# Altium project ie-track-kit-arduino-1.PrjPcb
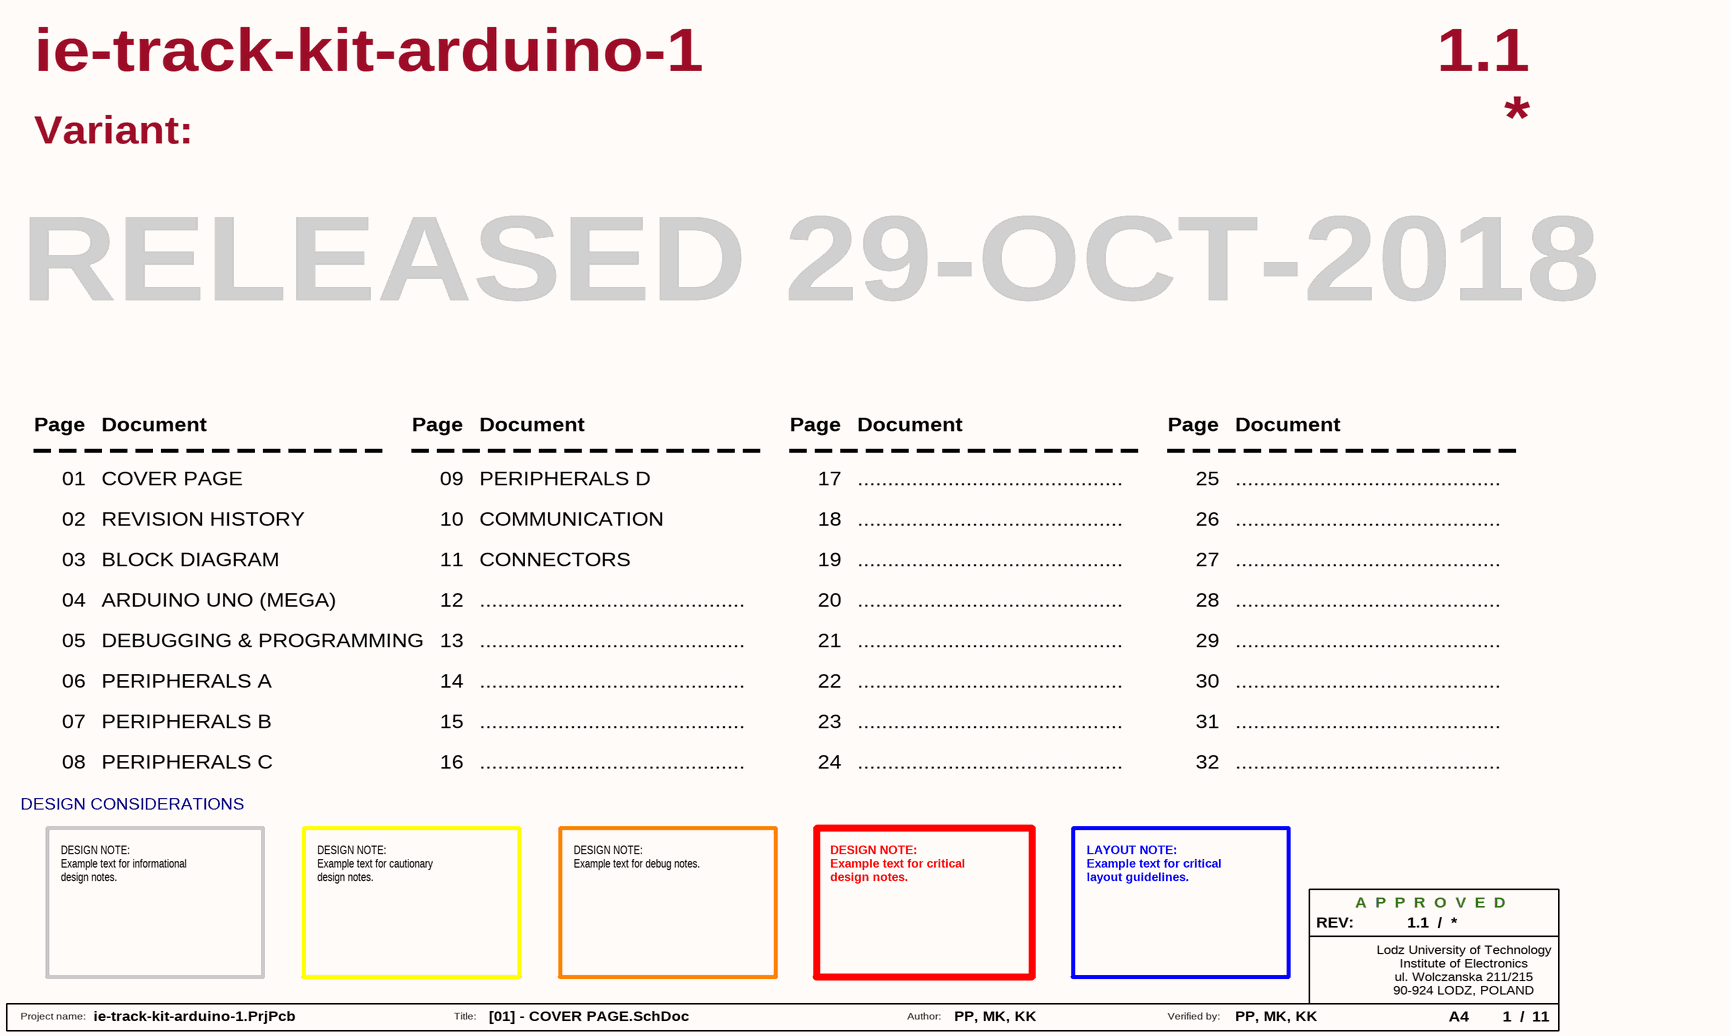
[diagram p0: [01] - COVER PAGE.SchDoc]
ProjectTitle: ie-track-kit-arduino-1; ProjectSheetTotal: 11; ProjectRevision: 1.1; ProjectDrawnBy: PP, MK, KK; ProjectCheckedBy: PP, MK, KK
11 sheets, 284 parts. Net scope: global (net labels, ports and power ports of the same name join across sheets).
Board file: ie-track-kit-arduino-1-V11.PcbDoc
Sheets:
  [01] - COVER PAGE.SchDoc
  [02] - REVISION HISTORY.SchDoc
  [03] - BLOCK DIAGRAM.SchDoc
    Voltage Conversion, Programming & Debug = [05] - DEBUGGING & PROGRAMMING.SchDoc
    Peripherals - A = [06] - PERIPHERALS A.SchDoc
    Bluetooth & 2,4GHz ISM = [10] - COMMUNICATION.SchDoc
    IE-TRACK-KIT-PWR Connector = [11] - CONNECTOR.SchDoc
    Arduino UNO/MEGA = [04] - ARDUINO UNO (MEGA).SchDoc
    Peripherals - B = [07] - PERIPHERALS B.SchDoc
    Peripherals - C = [08] - PERIPHERALS C.SchDoc
    Peripherals - D = [09] - PERIPHERALS D.SchDoc

## Sheet [01] - COVER PAGE.SchDoc: Test title
size A4; Projectnumber: OWN-000; Project name:: Test name; Date: YYYY-MM-DD; Engineer: X; SheetNumber: 1; Size: A4

### Notes on the sheet
- Variant:
- RELEASED 29-OCT-2018
- Page
- Document
- 01
- COVER PAGE
- 09
- PERIPHERALS D
- 17
- ............................................
- 25
- 02
- 03
- REVISION HISTORY
- BLOCK DIAGRAM
- 10
- 11
- COMMUNICATION
- CONNECTORS
- 18
- 19
- 26
- 27
- 04
- 05
- ARDUINO UNO (MEGA)
- DEBUGGING & PROGRAMMING
- 12
- 13
- 20
- 21
- 28
- 29
- 06
- PERIPHERALS A
- 14
- 22
- 30
- 07
- 08
- PERIPHERALS B
- PERIPHERALS C
- 15
- 16
- 23
- 24
- 31
- 32
- DESIGN CONSIDERATIONS
- DESIGN NOTE:
  Example text for informational
  design notes.
- DESIGN NOTE:
  Example text for cautionary
  design notes.
- DESIGN NOTE:
  Example text for debug notes.
- DESIGN NOTE:
  Example text for critical
  design notes.
- LAYOUT NOTE:
  Example text for critical
  layout guidelines.
- REV:
- A  P  P  R  O  V  E  D
- /
- Lodz University of Technology
- ul. Wolczanska 211/215
- 90-924 LODZ, POLAND
- Institute of Electronics
- Project name:
- Title:
- Author:
- Verified by:

## Sheet [02] - REVISION HISTORY.SchDoc: Test title
size A4; Project name:: Test name; Client: DSG; Date: YYYY-MM-DD; Engineer: X; SheetNumber: 2; Size: A4
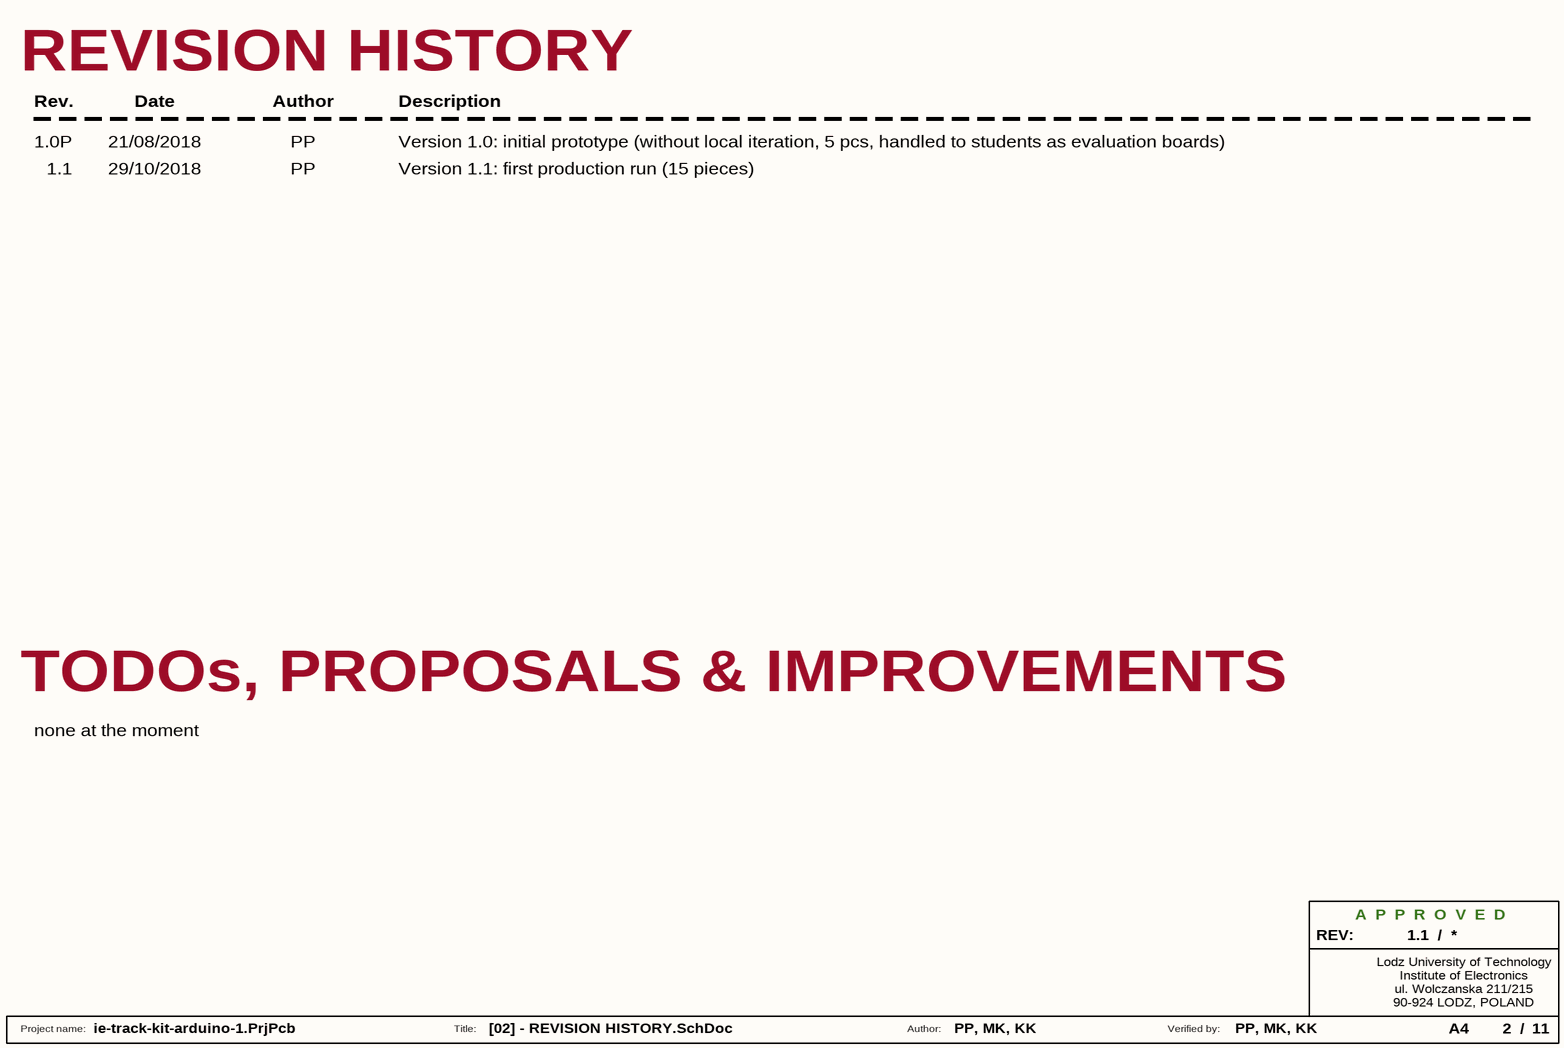
[diagram p1: [02] - REVISION HISTORY.SchDoc]

### Notes on the sheet
- REVISION HISTORY
- Rev.
- Date
- Author
- Description
- 1.0P
- 1.1
- 21/08/2018
- 29/10/2018
- PP
- Version 1.0: initial prototype (without local iteration, 5 pcs, handled to students as evaluation boards)
- Version 1.1: first production run (15 pieces)
- TODOs, PROPOSALS & IMPROVEMENTS
- none at the moment
- REV:
- A  P  P  R  O  V  E  D
- /
- Lodz University of Technology
- ul. Wolczanska 211/215
- 90-924 LODZ, POLAND
- Institute of Electronics
- Project name:
- Title:
- Author:
- Verified by:

## Sheet [03] - BLOCK DIAGRAM.SchDoc: Test title
size A4; PageSetup: Record=PageOptions|CenterHorizontal=True|CenterVertical=True|PrintScale=0.52|XCorrection=1.00|YCorrection=1.00|PrintKind=1|BorderSize=5000000|LeftOffset=0|BottomOffset=0|Orientation=2|PaperLength=1000|PaperWidth=1000|Scale=100|PaperSource=4|PrintQuality=600|MediaType=1|DitherType=10|PrintScaleMode=1|PaperKind=A4|PaperIndex=9; Projectnumber: OWN-000; Project name:: Test name; Client: DSG; Date: YYYY-MM-DD; Engineer: X; SheetNumber: 3; Size: A4
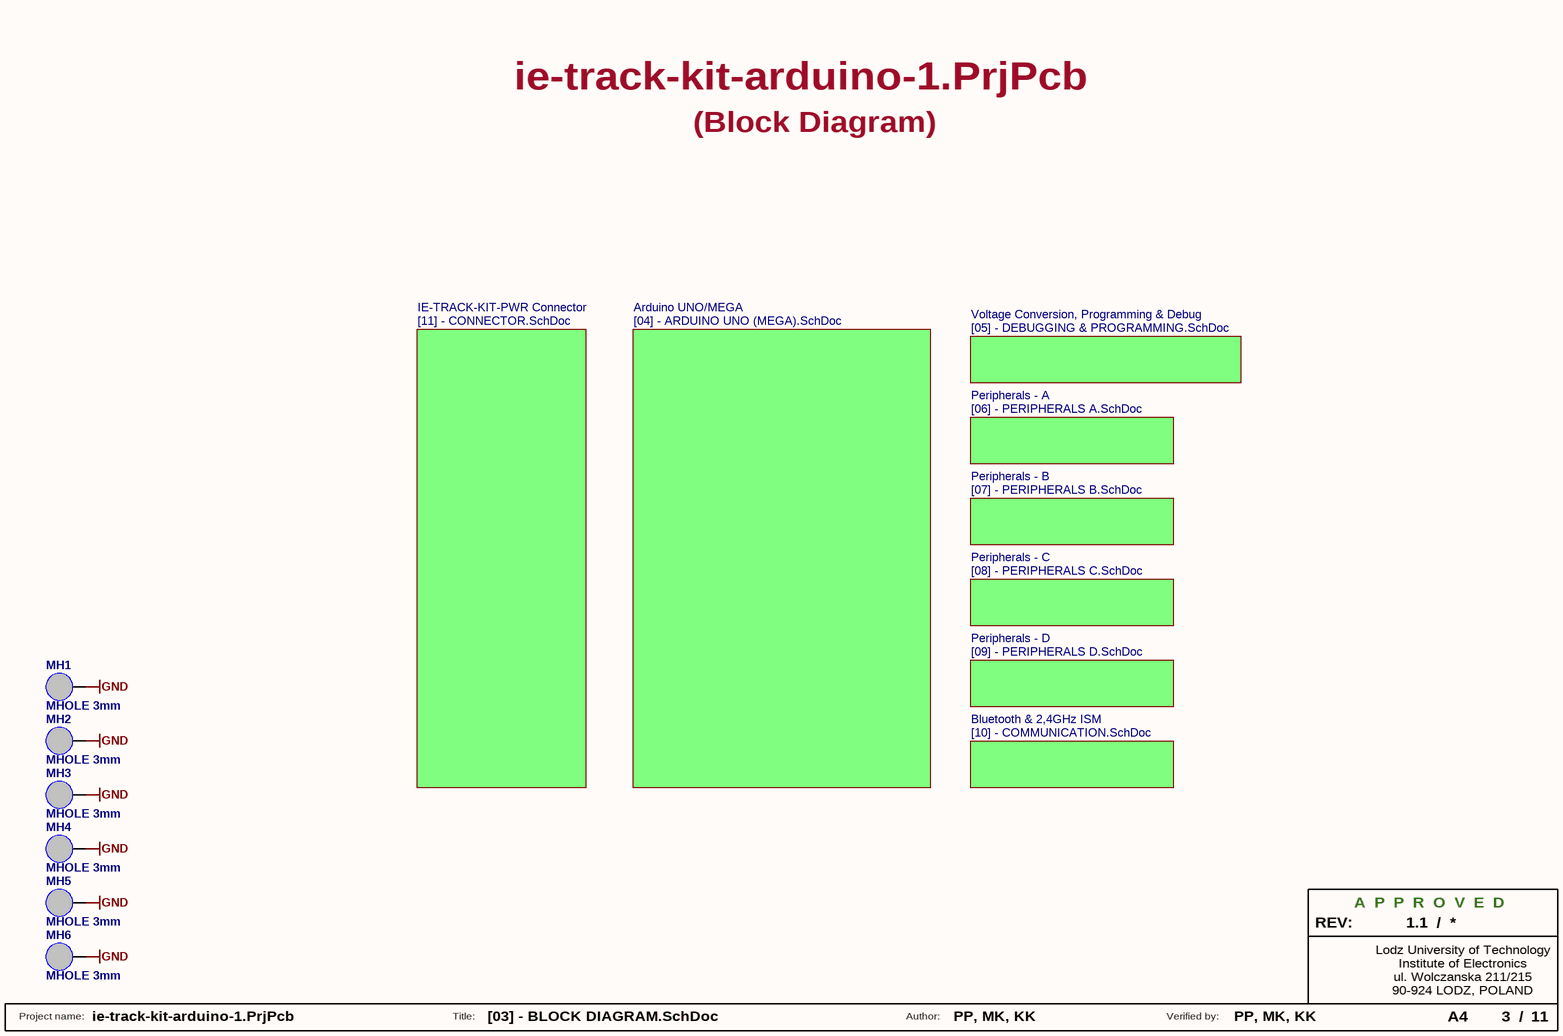
[diagram p2: [03] - BLOCK DIAGRAM.SchDoc]

### Parts
MH1  MHOLE 3mm  [3mm screw drill I]  (no BOM)
MH2  MHOLE 3mm  [3mm screw drill I]  (no BOM)
MH3  MHOLE 3mm  [3mm screw drill I]  (no BOM)
MH4  MHOLE 3mm  [3mm screw drill I]  (no BOM)
MH5  MHOLE 3mm  [3mm screw drill I]  (no BOM)
MH6  MHOLE 3mm  [3mm screw drill I]  (no BOM)

### Sub-sheets
Arduino UNO/MEGA = [04] - ARDUINO UNO (MEGA).SchDoc: no entries
Bluetooth & 2,4GHz ISM = [10] - COMMUNICATION.SchDoc: no entries
IE-TRACK-KIT-PWR Connector = [11] - CONNECTOR.SchDoc: no entries
Peripherals - A = [06] - PERIPHERALS A.SchDoc: no entries
Peripherals - B = [07] - PERIPHERALS B.SchDoc: no entries
Peripherals - C = [08] - PERIPHERALS C.SchDoc: no entries
Peripherals - D = [09] - PERIPHERALS D.SchDoc: no entries
Voltage Conversion, Programming & Debug = [05] - DEBUGGING & PROGRAMMING.SchDoc: no entries

### Nets
GND: MH1.1(GND) MH2.1(GND) MH3.1(GND) MH4.1(GND) MH5.1(GND) MH6.1(GND)

### Notes on the sheet
- (Block Diagram)
- REV:
- A  P  P  R  O  V  E  D
- /
- Lodz University of Technology
- ul. Wolczanska 211/215
- 90-924 LODZ, POLAND
- Institute of Electronics
- Project name:
- Title:
- Author:
- Verified by:

### Library data of the parts
MH1-MH6 = MHOLE_3MM: 3mm Mounting Hole

## Sheet [05] - DEBUGGING & PROGRAMMING.SchDoc: Test title
size A4; Date: YYYY-MM-DD; Engineer: X; SheetNumber: 5; Size: A4
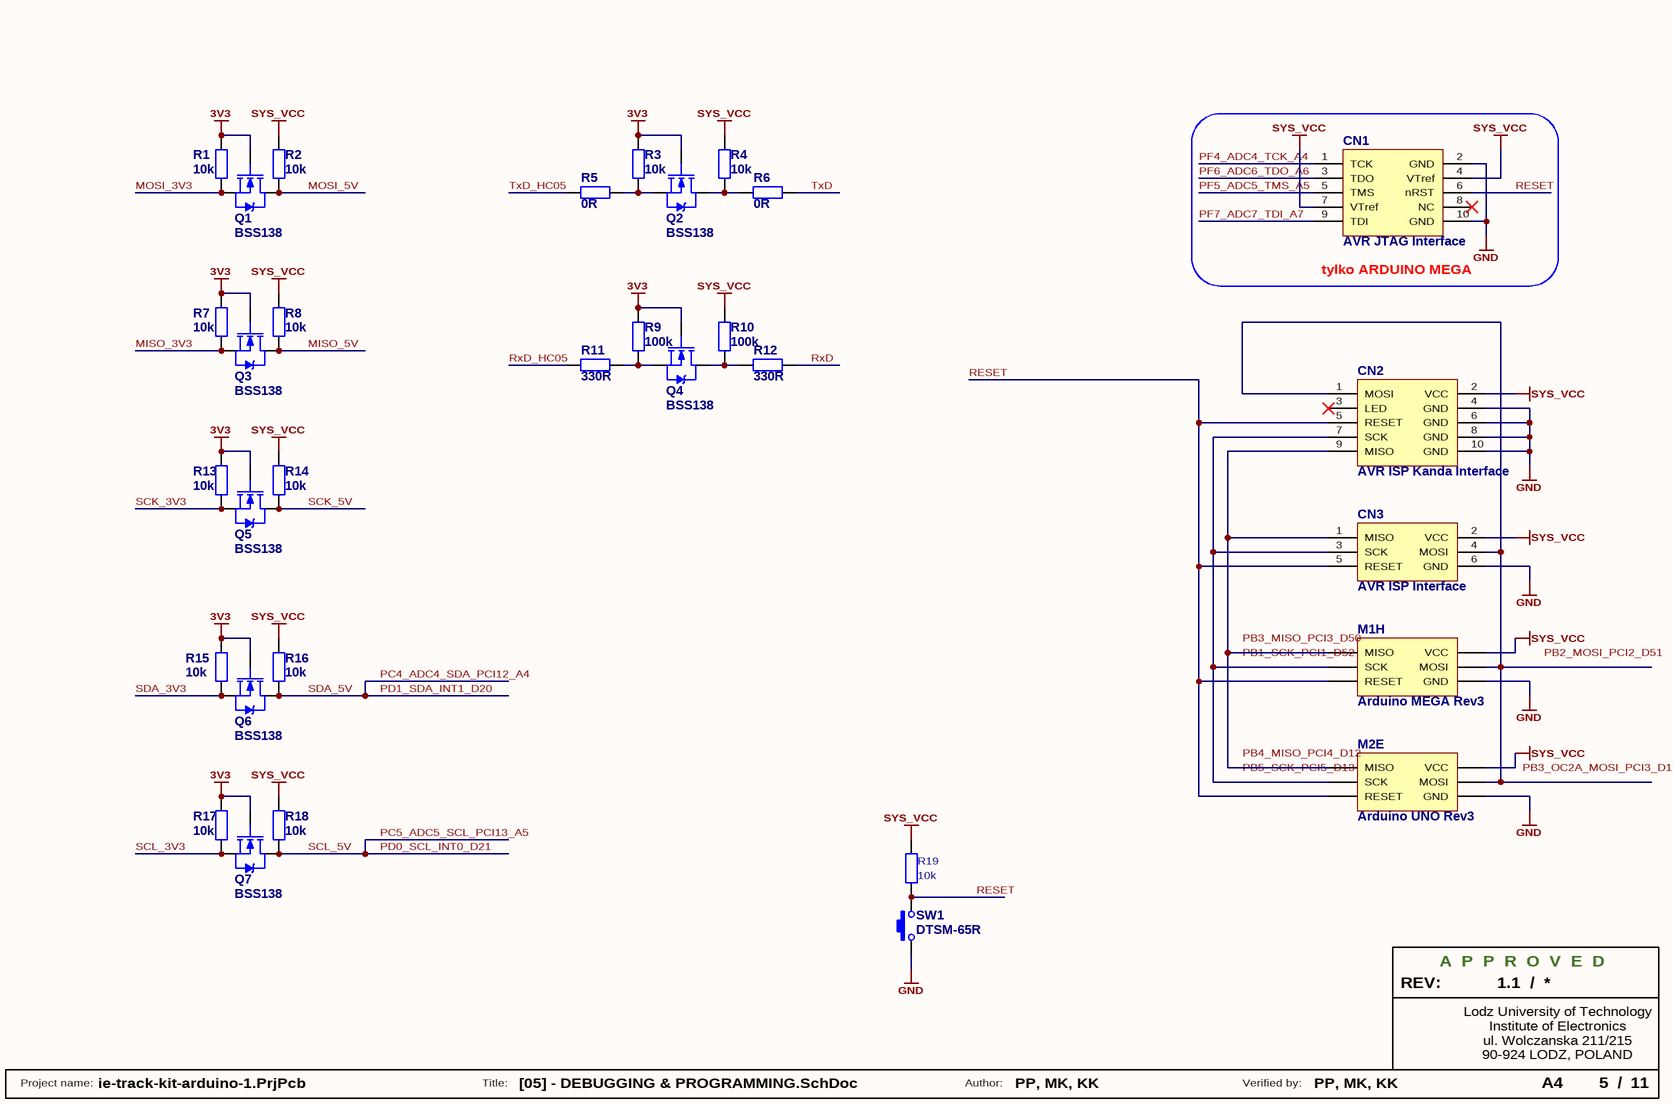
[diagram p3: [05] - DEBUGGING & PROGRAMMING.SchDoc]

### Parts
CN1  AVR JTAG Interface  [IDC10]
CN2  AVR ISP Kanda Interface  [IDC10]
CN3  AVR ISP Interface  [IDC6]
M1  Arduino MEGA Rev3  [Arduino_MEGA_UPSIDE_DOWN]  (part H of 8)
M2  Arduino UNO Rev3  [Arduino_UNO_UPSIDE_DOWN]  (part E of 5)
Q1  BSS138  [SOT-23]
Q2  BSS138  [SOT-23]
Q3  BSS138  [SOT-23]
Q4  BSS138  [SOT-23]
Q5  BSS138  [SOT-23]
Q6  BSS138  [SOT-23]
Q7  BSS138  [SOT-23]
R1  10k  [R0805]
R2  10k  [R0805]
R3  10k  [R0805]
R4  10k  [R0805]
R5  0R  [R0805]
R6  0R  [R0805]
R7  10k  [R0805]
R8  10k  [R0805]
R9  100k  [R0805]
R10  100k  [R0805]
R11  330R  [R0805]
R12  330R  [R0805]
R13  10k  [R0805]
R14  10k  [R0805]
R15  10k  [R0805]
R16  10k  [R0805]
R17  10k  [R0805]
R18  10k  [R0805]
R19  10k  [R0805]
SW1  DTSM-65R  [DTSM-65R]

### Blocks framed on the sheet
tylko ARDUINO MEGA: CN1

### Nets
3V3: Q1.1(G) Q2.1(G) Q3.1(G) Q4.1(G) Q5.1(G) Q6.1(G) Q7.1(G) R1.2 R3.1 R7.2 R9.1 R13.2 R15.2 R17.2
GND: CN1.2(GND) CN1.10(GND) CN2.4(GND) CN2.6(GND) CN2.8(GND) CN2.10(GND) CN3.6(GND) M1.PROG6(GND) M2.PROG6(GND) SW1.1
SYS_VCC: CN1.4(VTref) CN1.7(VTref) CN2.2(VCC) CN3.2(VCC) M1.PROG2(VCC) M2.PROG2(VCC) R2.2 R4.1 R8.2 R10.1 R14.2 R16.2 R18.2 R19.2
MISO_3V3: Q3.2(S) R7.1
MISO_5V: Q3.3(D) R8.1
MOSI_3V3: Q1.2(S) R1.1
MOSI_5V: Q1.3(D) R2.1
PC4_ADC4_SDA_PCI12_A4: Q6.3(D) R16.1  [also labelled PD1_SDA_INT1_D20, SDA_5V]
PC5_ADC5_SCL_PCI13_A5: Q7.3(D) R18.1  [also labelled PD0_SCL_INT0_D21, SCL_5V]
PF4_ADC4_TCK_A4: CN1.1(TCK)
PF5_ADC5_TMS_A5: CN1.5(TMS)
PF6_ADC6_TDO_A6: CN1.3(TDO)
PF7_ADC7_TDI_A7: CN1.9(TDI)
RESET: CN1.6(nRST) CN2.5(RESET) CN3.5(RESET) M1.PROG5(RESET) M2.PROG5(RESET) R19.1 SW1.2
RxD: R12.2  [project net PD0_RXD_PCI6_D0]
RxD_HC05: R11.1
SCK_3V3: Q5.2(S) R13.1
SCK_5V: Q5.3(D) R14.1
SCL_3V3: Q7.2(S) R17.1
SDA_3V3: Q6.2(S) R15.1
TxD: R6.2  [project net PD1_TXD_PCI17_D1]
TxD_HC05: R5.1
NetCN2_1: CN2.1(MOSI) CN3.4(MOSI) M1.PROG4(MOSI) M2.PROG4(MOSI)
NetCN2_7: CN2.7(SCK) CN3.3(SCK) M1.PROG3(SCK) M2.PROG3(SCK)
NetCN2_9: CN2.9(MISO) CN3.1(MISO) M1.PROG1(MISO) M2.PROG1(MISO)
NetQ2_2: Q2.2(S) R3.2 R5.2
NetQ2_3: Q2.3(D) R4.2 R6.1
NetQ4_2: Q4.2(S) R9.2 R11.2
NetQ4_3: Q4.3(D) R10.2 R12.1

Not connected (* = marked no-connect by the designer): CN1 8(NC)*; CN2 3(LED)*

### Notes on the sheet
- Labels drawn without touching a wire or pin: PB1_SCK_PCI1_D52, PB2_MOSI_PCI2_D51, PB3_MISO_PCI3_D50, PB3_OC2A_MOSI_PCI3_D11, PB4_MISO_PCI4_D12, PB5_SCK_PCI5_D13
- REV:
- A  P  P  R  O  V  E  D
- /
- Lodz University of Technology
- ul. Wolczanska 211/215
- 90-924 LODZ, POLAND
- Institute of Electronics
- Project name:
- Title:
- Author:
- Verified by:

### Library data of the parts
CN1 = AVR JTAG Interface: JTAG Header for AVR MCU's
CN2 = AVR ISP Kanda Interface: Kanda ISP Programming Header for AVR MCU's
CN3 = AVR ISP Interface: ISP Programming Header for AVR MCU's
M1 = Arduino MEGA Rev3: Arduino MEGA Rev3 Board
M2 = Arduino UNO Rev3: Arduino UNO Rev3 Board
Q1-Q7 = BSS138: N-Channel Enhancement Mode Vertical DMOS FET; Published: 17-Dec-2003; DatasheetVersion: Mar-96; PackageVersion: 1996; PackageReference: SOT23; Publisher: Altium Limited; PackageDescription: SOT-23; 3 Leads; Body 3.1 x 2.5 mm, inc. leads (LxW max), Alternate Lead Configuration; ComponentLink1Description: Manufacturer Link; ComponentLink1URL: http://www.zetex.com/; ComponentLink2Description: Datasheet; ComponentLink2URL: www.zetex.com/3.0/pdf/BSS138.pdf
R1-R19 = Res: Resistor; Published: 19-Feb-2006; ComponentLink1Description: datasheet; ComponentLink2Description: supplier
  R1-R4 R7 R8 R13-R19: Value: 10k
  R5 R6: Value: 0R
  R9 R10: Value: 100k
  R11 R12: Value: 330R
SW1 = DTSM-65R: DIPTRONICS Red 6x6mm SMD Tactile SPST-NO Switch; Supplier 1: TME; Supplier Part Number 1: DTSM-65R-V-B

## Sheet [06] - PERIPHERALS A.SchDoc: Test title
size A4; Date: YYYY-MM-DD; Engineer: X; SheetNumber: 6; Size: A4
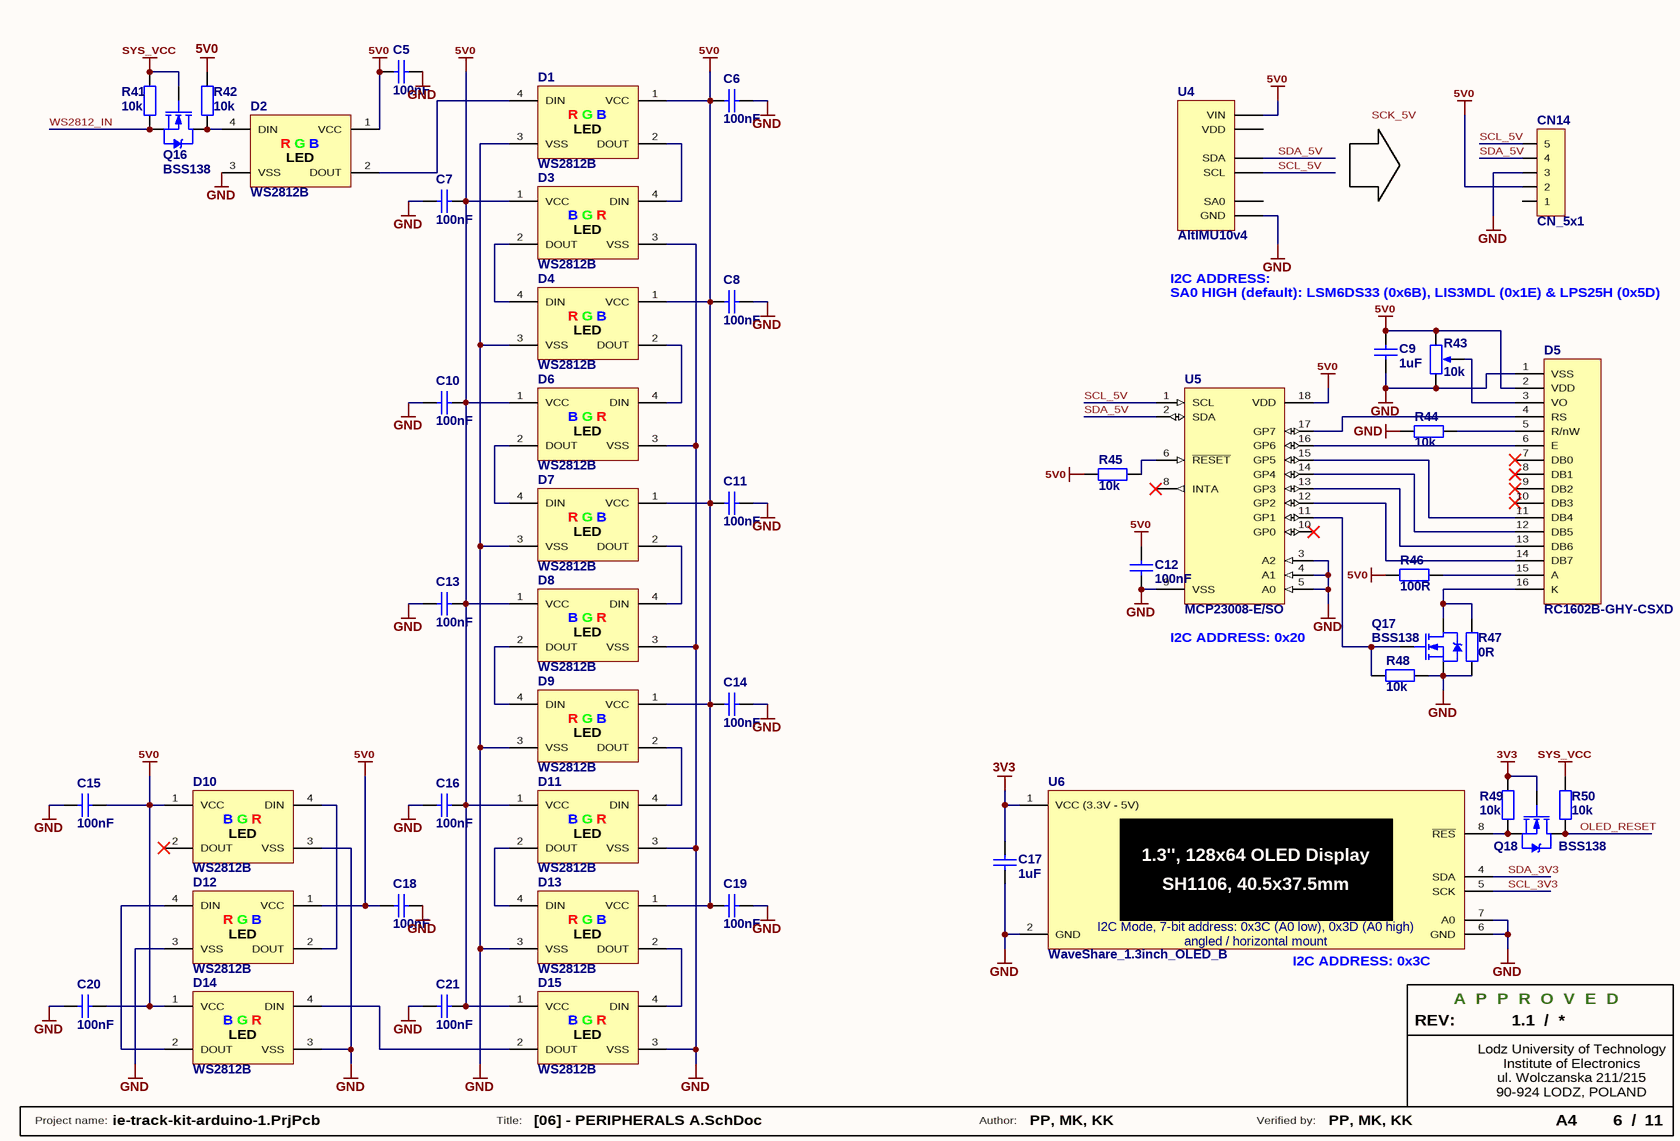
[diagram p4: [06] - PERIPHERALS A.SchDoc]

### Parts
C5  100nF  [C0805]
C6  100nF  [C0805]
C7  100nF  [C0805]
C8  100nF  [C0805]
C9  1uF  [C0805]
C10  100nF  [C0805]
C11  100nF  [C0805]
C12  100nF  [C0805]
C13  100nF  [C0805]
C14  100nF  [C0805]
C15  100nF  [C0805]
C16  100nF  [C0805]
C17  1uF  [C0805]
C18  100nF  [C0805]
C19  100nF  [C0805]
C20  100nF  [C0805]
C21  100nF  [C0805]
CN14  CN_5x1  [GP_5x1H_F]
D1  WS2812B  [WS2812B]
D2  WS2812B  [WS2812B]
D3  WS2812B  [WS2812B]
D4  WS2812B  [WS2812B]
D5  RC1602B-GHY-CSXD  [RC1602B-GHY-CSXD]
D6  WS2812B  [WS2812B]
D7  WS2812B  [WS2812B]
D8  WS2812B  [WS2812B]
D9  WS2812B  [WS2812B]
D10  WS2812B  [WS2812B]
D11  WS2812B  [WS2812B]
D12  WS2812B  [WS2812B]
D13  WS2812B  [WS2812B]
D14  WS2812B  [WS2812B]
D15  WS2812B  [WS2812B]
Q16  BSS138  [SOT-23]
Q17  BSS138  [SOT-23]
Q18  BSS138  [SOT-23]
R41  10k  [R0805]
R42  10k  [R0805]
R43  value 10k  [3305SMD]  (hidden comment: *)
R44  10k  [R0805]
R45  10k  [R0805]
R46  100R  [R0805]
R47  0R  [R0805]
R48  10k  [R0805]
R49  10k  [R0805]
R50  10k  [R0805]
U4  AltIMU10v4  [AltIMU-10 v4_REVERSE]
U5  MCP23008-E/SO  [SO18W]
U6  WaveShare_1.3inch_OLED_B  [WaveShare_1.3INCH_OLED]

### Nets
3V3: C17.2 Q18.1(G) R49.2 U6.1(VCC_(3.3V_-_5V))
5V0: C5.1 C6.1 C7.2 C8.1 C9.2 C10.2 C11.1 C12.2 C13.2 C14.1 C15.2 C16.2 C18.1 C19.1 C20.2 C21.2 CN14.2 D1.1(VCC) D2.1(VCC) D3.1(VCC) D4.1(VCC) D5.2(VDD) D6.1(VCC) D7.1(VCC) D8.1(VCC) D9.1(VCC) D10.1(VCC) D11.1(VCC) D12.1(VCC) D13.1(VCC) D14.1(VCC) D15.1(VCC) R42.2 R43.1(TOP) R45.1 R46.1 U4.3(VIN) U5.18(VDD)
GND: C5.2 C6.2 C7.1 C8.2 C9.1 C10.1 C11.2 C12.1 C13.1 C14.2 C15.1 C16.1 C17.1 C18.2 C19.2 C20.1 C21.1 CN14.3 D1.3(VSS) D2.3(VSS) D3.3(VSS) D4.3(VSS) D5.1(VSS) D6.3(VSS) D7.3(VSS) D8.3(VSS) D9.3(VSS) D10.3(VSS) D11.3(VSS) D12.3(VSS) D13.3(VSS) D14.3(VSS) D15.3(VSS) Q17.2(S) R43.2(BOT) R44.1 R47.2 R48.2 U4.1(GND) U5.3(A2) U5.4(A1) U5.5(A0) U5.9(VSS) U6.2(GND) U6.6(GND) U6.7(A0)
SYS_VCC: Q16.1(G) R41.2 R50.2
OLED_RESET: Q18.3(D) R50.1
SCL_3V3: U6.5(SCK)
SCL_5V: CN14.5 U4.6(SCL) U5.1(SCL)  [project net PC5_ADC5_SCL_PCI13_A5]
SDA_3V3: U6.4(SDA)
SDA_5V: CN14.4 U4.5(SDA) U5.2(SDA)  [project net PC4_ADC4_SDA_PCI12_A4]
WS2812_IN: Q16.2(S) R41.1  [project net PC1_ADC1_PCI9_A1]
NetD1_2: D1.2(DOUT) D3.4(DIN)
NetD1_4: D1.4(DIN) D2.2(DOUT)
NetD2_4: D2.4(DIN) Q16.3(D) R42.1
NetD3_2: D3.2(DOUT) D4.4(DIN)
NetD4_2: D4.2(DOUT) D6.4(DIN)
NetD5_3: D5.3(VO) R43.3(TAP)
NetD5_4: D5.4(RS) U5.17(GP7)
NetD5_5: D5.5(R/nW) R44.2
NetD5_6: D5.6(E) U5.16(GP6)
NetD5_11: D5.11(DB4) U5.15(GP5)
NetD5_12: D5.12(DB5) U5.14(GP4)
NetD5_13: D5.13(DB6) U5.13(GP3)
NetD5_14: D5.14(DB7) U5.12(GP2)
NetD5_15: D5.15(A) R46.2
NetD5_16: D5.16(K) Q17.3(D) R47.1
NetD6_2: D6.2(DOUT) D7.4(DIN)
NetD7_2: D7.2(DOUT) D8.4(DIN)
NetD8_2: D8.2(DOUT) D9.4(DIN)
NetD9_2: D9.2(DOUT) D11.4(DIN)
NetD10_4: D10.4(DIN) D12.2(DOUT)
NetD11_2: D11.2(DOUT) D13.4(DIN)
NetD12_4: D12.4(DIN) D14.2(DOUT)
NetD13_2: D13.2(DOUT) D15.4(DIN)
NetD14_4: D14.4(DIN) D15.2(DOUT)
NetQ17_1: Q17.1(G) R48.1 U5.11(GP1)
NetQ18_2: Q18.2(S) R49.1 U6.8(~{RES})
NetR45_2: R45.2 U5.6(~{RESET})

Not connected (* = marked no-connect by the designer): CN14 1; D5 7(DB0)* 8(DB1)* 9(DB2)* 10(DB3)*; D10 2(DOUT)*; U4 2(SA0) 4(VDD); U5 8(INTA)* 10(GP0)*

### Notes on the sheet
- SA0 HIGH (default): LSM6DS33 (0x6B), LIS3MDL (0x1E) & LPS25H (0x5D)
- I2C ADDRESS:
- I2C ADDRESS: 0x20
- (near U6) I2C ADDRESS: 0x3C
- Labels drawn without touching a wire or pin: SCK_5V
- REV:
- A  P  P  R  O  V  E  D
- /
- Lodz University of Technology
- ul. Wolczanska 211/215
- 90-924 LODZ, POLAND
- Institute of Electronics
- Project name:
- Title:
- Author:
- Verified by:
- (in symbol WaveShare_1.3inch_OLED) 1.3'', 128x64 OLED Display; SH1106, 40.5x37.5mm; I2C Mode, 7-bit address: 0x3C (A0 low), 0x3D (A0 high); angled / horizontal mount
- (in symbol WS2812B) R; G; B; LED

### Library data of the parts
C5-C21 = Cap: Capacitor; ComponentLink1Description: datasheet; ComponentLink2Description: supplier
  C5-C8 C10-C16 C18-C21: Value: 100nF
  C9 C17: Value: 1uF
D1-D4 D6-D15 = WS2812B: Intelligent control LED integrated light source
D5 = RC1602B-GHY-CSXD: 16x2 LCD Display
Q16-Q18 = BSS138: as Q1 on sheet [05] - DEBUGGING & PROGRAMMING; Published: 17-Dec-2003; DatasheetVersion: Mar-96; PackageVersion: 1996; PackageReference: SOT23; Publisher: Altium Limited; PackageDescription: SOT-23; 3 Leads; Body 3.1 x 2.5 mm, inc. leads (LxW max), Alternate Lead Configuration; ComponentLink1Description: Manufacturer Link; ComponentLink1URL: http://www.zetex.com/; ComponentLink2Description: Datasheet; ComponentLink2URL: www.zetex.com/3.0/pdf/BSS138.pdf
R41 R42 R44-R50 = Res: Resistor; Published: 19-Feb-2006; ComponentLink1Description: datasheet; ComponentLink2Description: supplier
  R41 R42 R44 R45 R48-R50: Value: 10k
  R46: Value: 100R
  R47: Value: 0R
R43 = 3305SMD-10K: Published: 21-10-2009; ComponentLink1Description: datasheet; ComponentLink2Description: supplier
U4 = AltIMU10v4: Pololu Gyro, Accelerometer, Compass, and Altimeter (L3GD20H, LSM303D, and LPS25H Carrier)
U5 = MCP23008-E/SO: 8-Bit I/O Expander with Serial Interface I2C, 18-Pin SOIC Package
U6 = WaveShare_1.3inch_OLED: DEP096032B-W OLED Display

## Sheet [10] - COMMUNICATION.SchDoc: Test title
size A4; Projectnumber: OWN-000; Date: YYYY-MM-DD; Engineer: X; SheetNumber: 10; Size: A4
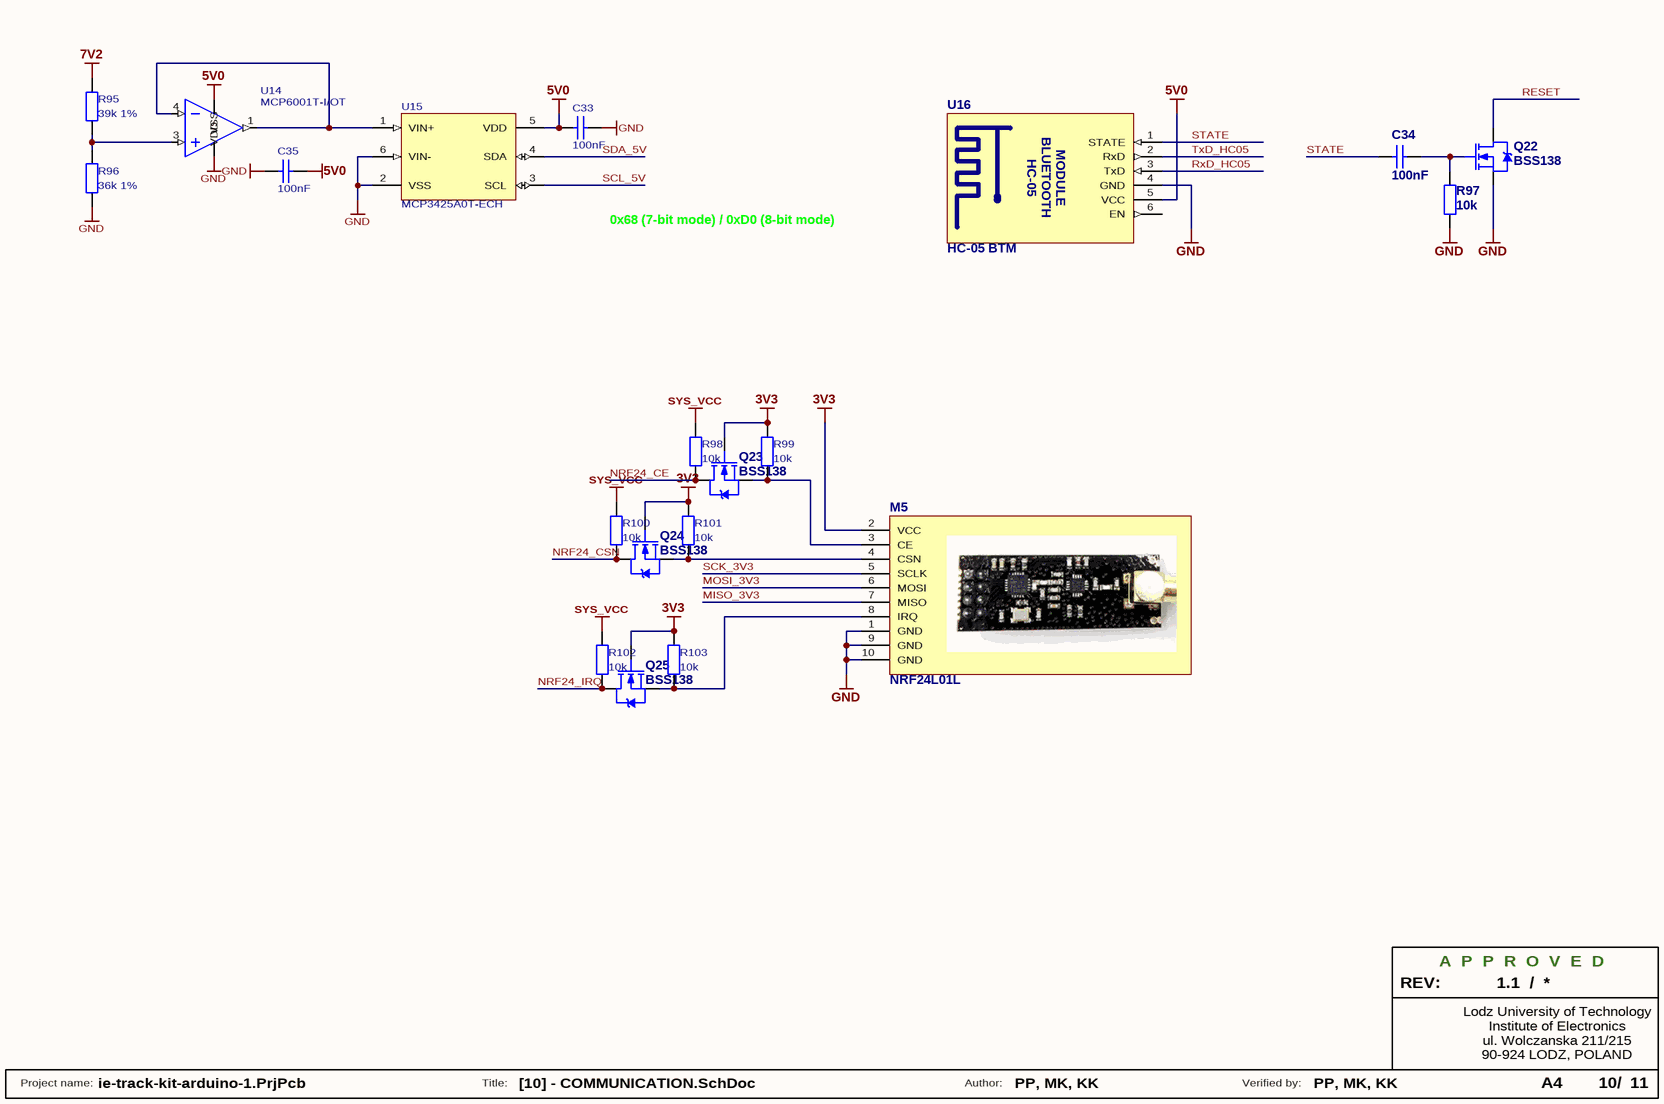
[diagram p5: [10] - COMMUNICATION.SchDoc]

### Parts
C33  100nF  [C0805]
C34  100nF  [C0805]
C35  100nF  [C0805]
M5  NRF24L01L  [NRF24L01L]
Q22  BSS138  [SOT-23]
Q23  BSS138  [SOT-23]
Q24  BSS138  [SOT-23]
Q25  BSS138  [SOT-23]
R95  39k 1%  [R0805]
R96  36k 1%  [R0805]
R97  10k  [R0805]
R98  10k  [R0805]
R99  10k  [R0805]
R100  10k  [R0805]
R101  10k  [R0805]
R102  10k  [R0805]
R103  10k  [R0805]
U14  MCP6001T-I/OT  [SOT-23-5]
U15  MCP3425A0T-ECH  [SOT-23-6]
U16  HC-05 BTM  [HC-05_H_2]

### Nets
3V3: M5.2(VCC) Q23.1(G) Q24.1(G) Q25.1(G) R99.1 R101.1 R103.1
5V0: C33.1 C35.1 U14.5(VDD) U15.5(VDD) U16.5(VCC)
7V2: R95.1
GND: C33.2 C35.2 M5.1(GND) M5.9(GND) M5.10(GND) Q22.2(S) R96.2 R97.2 U14.2(VSS) U15.2(VSS) U15.6(VIN-) U16.4(GND)
SYS_VCC: R98.1 R100.1 R102.1
MISO_3V3: M5.7(MISO)
MOSI_3V3: M5.6(MOSI)
NRF24_CE: Q23.3(D) R98.2
NRF24_CSN: Q24.3(D) R100.2
NRF24_IRQ: Q25.3(D) R102.2
RESET: Q22.3(D)
RxD_HC05: U16.3(TxD)
SCK_3V3: M5.5(SCLK)
SCL_5V: U15.3(SCL)  [project net PC5_ADC5_SCL_PCI13_A5]
SDA_5V: U15.4(SDA)  [project net PC4_ADC4_SDA_PCI12_A4]
STATE: C34.1 U16.1(STATE)
TxD_HC05: U16.2(RxD)
NetC34_2: C34.2 Q22.1(G) R97.1
NetM5_3: M5.3(CE) Q23.2(S) R99.2
NetM5_4: M5.4(CSN) Q24.2(S) R101.2
NetM5_8: M5.8(IRQ) Q25.2(S) R103.2
NetR95_2: R95.2 R96.1 U14.3(IN+)
NetU14_1: U14.1(OUT) U14.4(IN-) U15.1(VIN+)

Not connected (* = marked no-connect by the designer): U16 6(EN)

### Notes on the sheet
- (near U15) 0x68 (7-bit mode) / 0xD0 (8-bit mode)
- REV:
- A  P  P  R  O  V  E  D
- /
- Lodz University of Technology
- ul. Wolczanska 211/215
- 90-924 LODZ, POLAND
- Institute of Electronics
- Project name:
- Title:
- Author:
- Verified by:
- (in symbol HC-05_BTM) HC-05; BLUETOOTH; MODULE

### Library data of the parts
C33-C35 = Cap: Capacitor; ComponentLink1Description: datasheet; ComponentLink2Description: supplier; Value: 100nF
M5 = NRF24L01L: Long Range Wireless Module R2 (1.1KM, PA+SMA)
Q22-Q25 = BSS138: as Q1 on sheet [05] - DEBUGGING & PROGRAMMING; Published: 17-Dec-2003; DatasheetVersion: Mar-96; PackageVersion: 1996; PackageReference: SOT23; Publisher: Altium Limited; PackageDescription: SOT-23; 3 Leads; Body 3.1 x 2.5 mm, inc. leads (LxW max), Alternate Lead Configuration; ComponentLink1Description: Manufacturer Link; ComponentLink1URL: http://www.zetex.com/; ComponentLink2Description: Datasheet; ComponentLink2URL: www.zetex.com/3.0/pdf/BSS138.pdf
R95-R103 = Res: Resistor; Published: 19-Feb-2006; ComponentLink1Description: datasheet; ComponentLink2Description: supplier
  R95: Value: 39k 1%
  R96: Value: 36k 1%
  R97-R103: Value: 10k
U14 = MCP6001T-I/OT: Rail-to-rail, 1MHz, 100uA Op Amp; Supplier 1: Farnell; Supplier 2: TME; Supplier Part Number 1: 1825040; Supplier Part Number 2: MCP6401T-E/OT
U15 = MCP3425A0T-ECH: 16-Bit Analog-to-Digital Converter with I2C Interface and On-Board Reference; Supplier 1: Farnell; Supplier 2: Farnell; Supplier 3: Farnell; Supplier 4: TME; Supplier Part Number 1: 1578433; Supplier Part Number 2: 2371380; Supplier Part Number 3: 1578433RL; Supplier Part Number 4: MCP3425A0T-ECH
U16 = HC-05_BTM: HC-05 Bluetooth Module

## Sheet [11] - CONNECTOR.SchDoc: Test title
size A4; Date: YYYY-MM-DD; Engineer: X; SheetNumber: 11; Size: A4
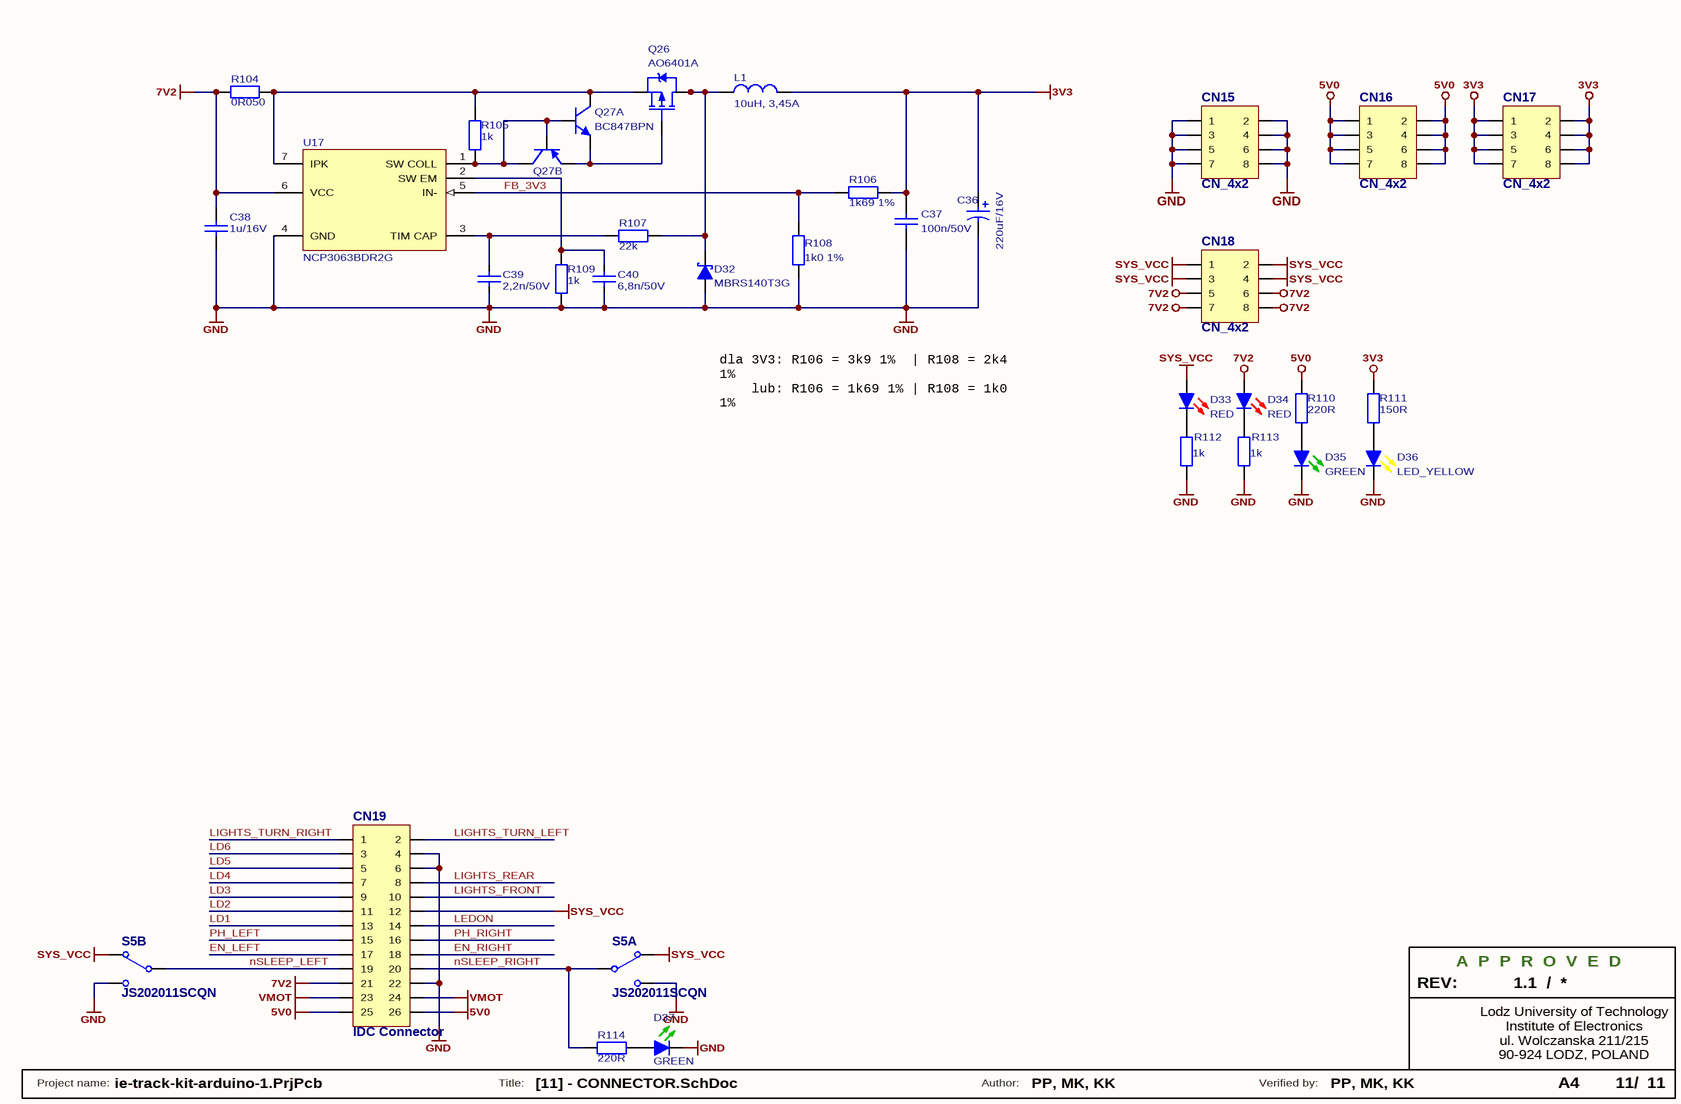
[diagram p6: [11] - CONNECTOR.SchDoc]

### Parts
C36  220uF/16V  [CES_E_8.3x8.3_6.2]
C37  100n/50V  [C0805]
C38  1u/16V  [C0805]
C39  2,2n/50V  [C0805]
C40  6,8n/50V  [C0805]
CN15  CN_4x2  [GP_4x2]
CN16  CN_4x2  [GP_4x2]
CN17  CN_4x2  [GP_4x2]
CN18  CN_4x2  [GP_4x2]
CN19  IDC Connector  [IDC26_RA_LONG_W_CN]
D32  MBRS140T3G  [SMB]
D33  RED  [LED0805R]
D34  RED  [LED0805R]
D35  GREEN  [LED0805G]
D36  LED_YELLOW  [LED0805Y]
D37  GREEN  [LED0805G]
L1  10uH, 3,45A  [PSDB1005]
Q26  AO6401A  [SOT-23-6]
Q27  BC847BPN  [SOT-323-6 (SOT-363, SC88, SC70-6)]  (parts A,B of 2)
R104  0R050  [R0805]
R105  1k  [R0805]
R106  1k69 1%  [R0805]
R107  22k  [R0805]
R108  1k0 1%  [R0805]
R109  1k  [R0805]
R110  220R  [R0805]
R111  150R  [R0805]
R112  1k  [R0805]
R113  1k  [R0805]
R114  220R  [R0805]
S5  JS202011SCQN  [JS202011SCQN]  (parts A,B of 2)
U17  NCP3063BDR2G  [SO8]

### Nets
3V3: C36.1 C37.2 CN17.1 CN17.2 CN17.3 CN17.4 CN17.5 CN17.6 CN17.7 CN17.8 L1.2 R106.2 R111.1
5V0: CN16.1 CN16.2 CN16.3 CN16.4 CN16.5 CN16.6 CN16.7 CN16.8 CN19.25 CN19.26 R110.1
7V2: C38.2 CN18.5 CN18.6 CN18.7 CN18.8 CN19.21 D34.1(A) R104.1 U17.6(VCC)
GND: C36.2 C37.1 C38.1 C39.1 C40.1 CN15.1 CN15.2 CN15.3 CN15.4 CN15.5 CN15.6 CN15.7 CN15.8 CN19.4 CN19.6 CN19.22 D32.1(A) D35.2(K) D36.2(K) D37.2(K) R108.2 R109.2 R112.2 R113.2 S5.3(NO1) S5.6(NO2) U17.4(GND)
SYS_VCC: CN18.1 CN18.2 CN18.3 CN18.4 CN19.12 D33.1(A) S5.2(NC1) S5.4(NC2)
VMOT: CN19.23 CN19.24
EN_LEFT: CN19.17
EN_RIGHT: CN19.18
FB_3V3: R106.1 R108.1 U17.5(IN-)
LD1: CN19.13
LD2: CN19.11
LD3: CN19.9
LD4: CN19.7
LD5: CN19.5
LD6: CN19.3
LEDON: CN19.14
LIGHTS_FRONT: CN19.10
LIGHTS_REAR: CN19.8
LIGHTS_TURN_LEFT: CN19.2
LIGHTS_TURN_RIGHT: CN19.1
nSLEEP_LEFT: CN19.19 S5.5(COMMON2)
nSLEEP_RIGHT: CN19.20 R114.1 S5.1(COMMON1)
PH_LEFT: CN19.15  [project net PD2_INT0_PCI18_D2]
PH_RIGHT: CN19.16  [project net PD3_INT1_OC2B_PCI19_D3]
NetC39_2: C39.2 R107.2 U17.3(TIM_CAP)
NetC40_2: C40.2 R109.1 U17.2(SW_EM)
NetD32_2: D32.2(K) L1.1 Q26.1(D) Q26.2(D) Q26.5(D) Q26.6(D) R107.1
NetD33_2: D33.2(K) R112.1
NetD34_2: D34.2(K) R113.1
NetD35_1: D35.1(A) R110.2
NetD36_1: D36.1(A) R111.2
NetD37_1: D37.1(A) R114.2
NetQ26_3: Q26.3(G) Q27.1(EA) Q27.4(EB)
NetQ26_4: Q26.4(S) Q27.6(CA) R104.2 R105.1 U17.7(IPK)
NetQ27_2: Q27.2(BA) Q27.3(CB) Q27.5(BB) R105.2 U17.1(SW_COLL)

### Notes on the sheet
- dla 3V3: R106 = 3k9 1%  | R108 = 2k4 1%
  lub: R106 = 1k69 1% | R108 = 1k0 1%
- REV:
- A  P  P  R  O  V  E  D
- /
- Lodz University of Technology
- ul. Wolczanska 211/215
- 90-924 LODZ, POLAND
- Institute of Electronics
- Project name:
- Title:
- Author:
- Verified by:

### Library data of the parts
C36 = Cap Pol: Polarized Capacitor; ComponentLink1Description: datasheet; ComponentLink2Description: supplier; Value: 220uF/16V
C37-C40 = Cap: Capacitor; ComponentLink1Description: datasheet; ComponentLink2Description: supplier
  C37: Value: 100n/50V
  C38: Value: 1u/16V
  C39: Value: 2,2n/50V
  C40: Value: 6,8n/50V
CN19 = CN_13x2
D32 = MBRS140T3G: Schottky barrier rectifier: 40V, 1A; Published: 22-Nov-2006; PackageReference: SMB; Supplier 1: TME; Supplier 2: Farnell; Supplier Part Number 1: MBRS140T3G; Supplier Part Number 2: 1467526
D33 D34 = LED_RED: RED LED; Published: 04-Apr-2006
D35 D37 = LED_GREEN: GREEN LED; Published: 04-Apr-2006
D36 = LED_YELLOW: YELLOW LED; Published: 04-Apr-2006
L1 = PSDB1005NT100: 10uH, 20%, 3,45A, PSDB1005N Series Inductor; Published: 08-Mar-2006; ComponentLink1Description: datasheet; ComponentLink2Description: supplier; Supplier 1: TME; Supplier Part Number 1: PSDB1005NT100; Value: 10uH, 3,45A
Q26 = AO6401A: P-Channel MOSFET; -60V, -5A, 1.3W;; Supplier 1: TME; Supplier Part Number 1: AO6401A
Q27 = BC847BPN: PNP/NPN General Purpose Transistor (VCE=45V, IC=100mA); Supplier 1: TME; Supplier 2: Farnell; Supplier 3: Farnell; Supplier 4: Farnell; Supplier Part Number 1: BC847BPN.115; Supplier Part Number 2: 2336824; Supplier Part Number 3: 1081233RL; Supplier Part Number 4: 1081233
R104-R114 = Res: Resistor; Published: 19-Feb-2006; ComponentLink1Description: datasheet; ComponentLink2Description: supplier
  R104: Value: 0R050
  R105 R109 R112 R113: Value: 1k
  R106: Value: 1k69 1%
  R107: Value: 22k
  R108: Value: 1k0 1%
  R110 R114: Value: 220R
  R111: Value: 150R
S5 = JS202011SCQN: C&K JS202011SCQN DPDT Switch; Published: 24-Mar-1999; Revision: July-2002: Re-released for DXP Platform.; Publisher: Altium Limited; Supplier 1: Farnell; Supplier 2: Farnell; Supplier Part Number 1: 2320019RL; Supplier Part Number 2: 2320019
U17 = NCP3063BDR2G: DC-DC Converter NCP3063BDR2G (Farnell 1547126); Published: 22-Nov-2006; PackageReference: SO8; Supplier 1: Farnell; Supplier 2: Farnell; Supplier 3: Farnell; Supplier Part Number 1: 1547126; Supplier Part Number 2: 2126136; Supplier Part Number 3: 1547126RL

## Sheet [04] - ARDUINO UNO (MEGA).SchDoc: Test title
size A4; Date: YYYY-MM-DD; Engineer: X; SheetNumber: 4; Size: A4
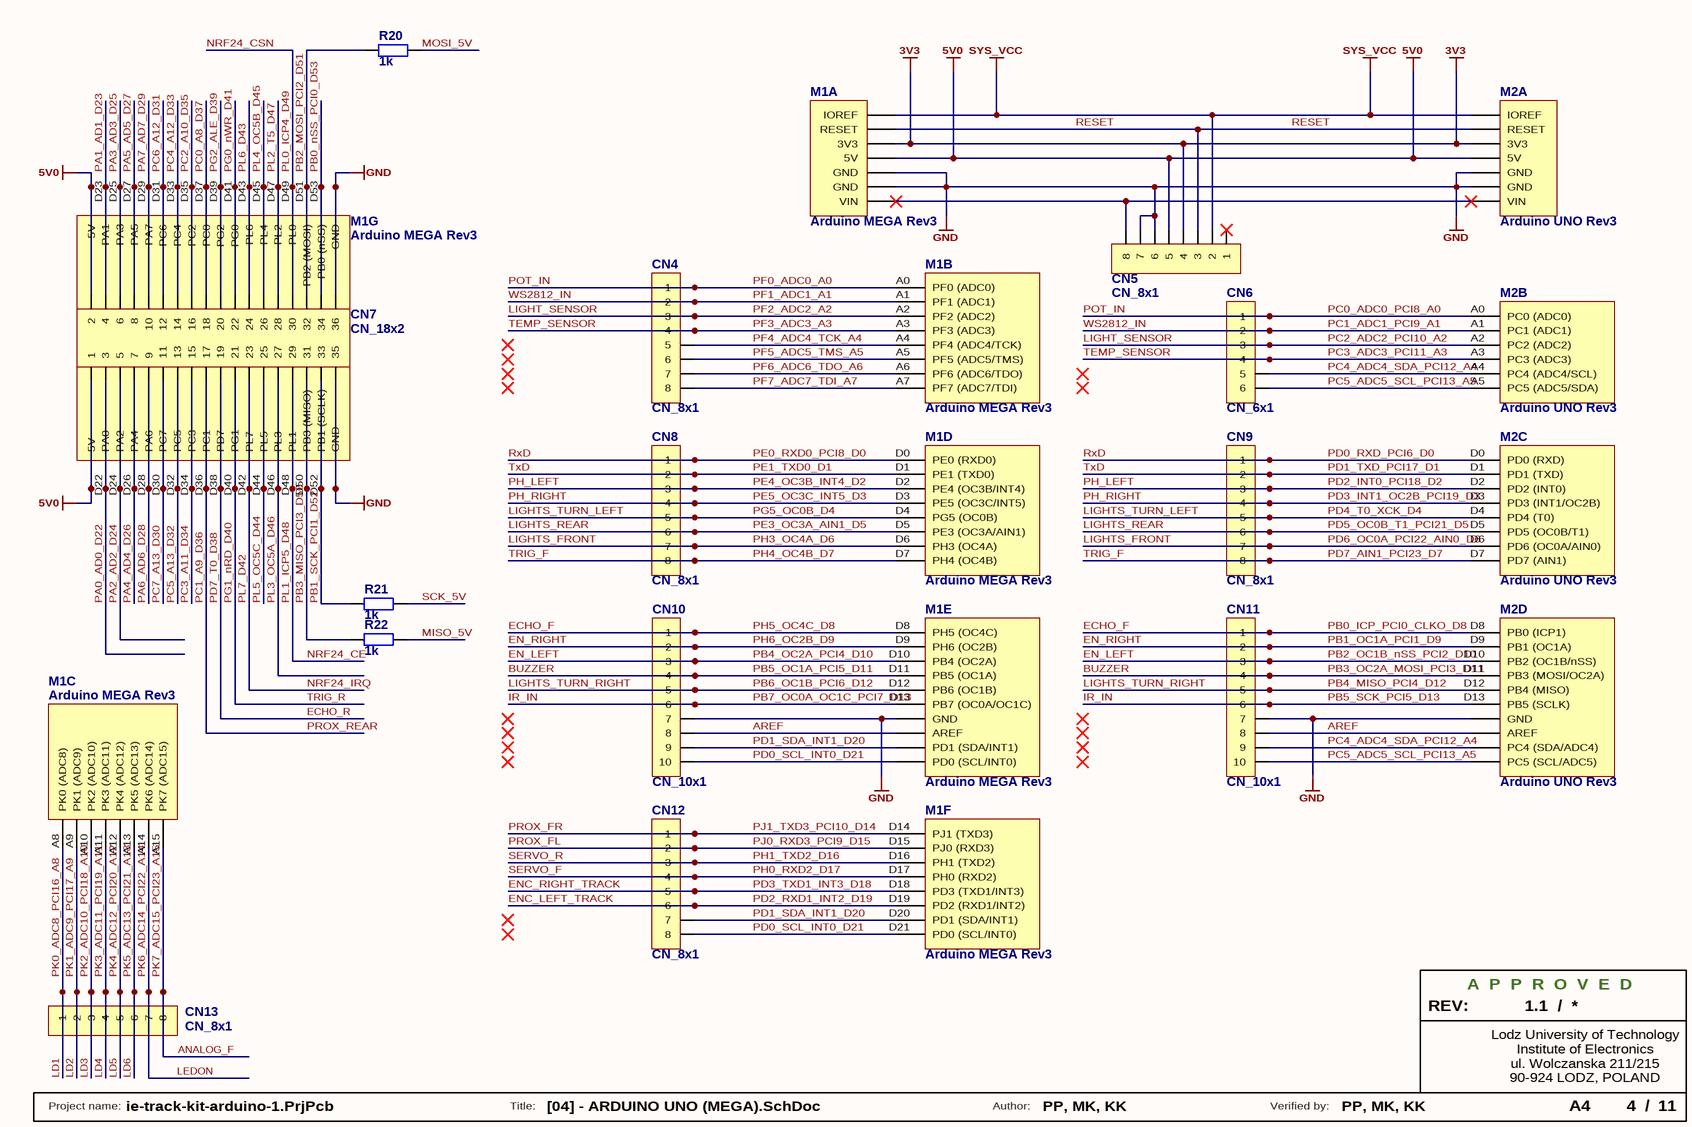
[diagram p7: [04] - ARDUINO UNO (MEGA).SchDoc]

### Parts
CN4  CN_8x1  [GP_8x1]
CN5  CN_8x1  [GP_8x1]
CN6  CN_6x1  [GP_6x1]
CN7  CN_18x2  [GP_18x2]
CN8  CN_8x1  [GP_8x1]
CN9  CN_8x1  [GP_8x1]
CN10  CN_10x1  [GP_10x1]
CN11  CN_10x1  [GP_10x1]
CN12  CN_8x1  [GP_8x1]
CN13  CN_8x1  [GP_8x1]
M1  Arduino MEGA Rev3  [Arduino_MEGA_UPSIDE_DOWN]  (parts A,B,C,D,E,F,G of 8)
M2  Arduino UNO Rev3  [Arduino_UNO_UPSIDE_DOWN]  (parts A,B,C,D of 5)
R20  1k  [R0805]
R21  1k  [R0805]
R22  1k  [R0805]

### Nets
3V3: CN5.4 M1.P4(3V3) M2.P4(3V3)
5V0: CN5.5 CN7.1 CN7.2 M1.5V M1.P5(5V) M2.P5(5V)
GND: CN5.6 CN5.7 CN7.35 CN7.36 CN10.7 CN11.7 M1.GND M1.P6(GND) M1.P7(GND) M2.GND M2.P6(GND) M2.P7(GND)
SYS_VCC: CN5.2 M1.P2(IOREF) M2.P2(IOREF)
ANALOG_F: CN13.8 M1.A15(PK7_(ADC15))  [also labelled PK7_ADC15_PCI23_A15]
AREF: CN10.8 CN11.8 M1.AREF M2.AREF
BUZZER: CN10.4 CN11.4 M1.D11(PB5_(OC1A)) M2.D11(PB3_(MOSI/OC2A))  [also labelled PB3_OC2A_MOSI_PCI3_D11, PB5_OC1A_PCI5_D11]
ECHO_F: CN10.1 CN11.1 M1.D8(PH5_(OC4C)) M2.D8(PB0_(ICP1))  [also labelled PB0_ICP_PCI0_CLKO_D8, PH5_OC4C_D8]
ECHO_R: CN7.19 M1.D38(PD7)  [also labelled PD7_T0_D38]
EN_LEFT: CN10.3 CN11.3 M1.D10(PB4_(OC2A)) M2.D10(PB2_(OC1B/nSS))  [also labelled PB2_OC1B_nSS_PCI2_D10, PB4_OC2A_PCI4_D10]
EN_RIGHT: CN10.2 CN11.2 M1.D9(PH6_(OC2B)) M2.D9(PB1_(OC1A))  [also labelled PB1_OC1A_PCI1_D9, PH6_OC2B_D9]
ENC_LEFT_TRACK: CN12.6 M1.D19(PD2_(RXD1/INT2))  [also labelled PD2_RXD1_INT2_D19]
ENC_RIGHT_TRACK: CN12.5 M1.D18(PD3_(TXD1/INT3))  [also labelled PD3_TXD1_INT3_D18]
IR_IN: CN10.6 CN11.6 M1.D13(PB7_(OC0A/OC1C)) M2.D13(PB5_(SCLK))  [also labelled PB5_SCK_PCI5_D13, PB7_OC0A_OC1C_PCI7_D13]
LD1: CN13.1 M1.A8(PK0_(ADC8))  [also labelled PK0_ADC8_PCI16_A8]
LD2: CN13.2 M1.A9(PK1_(ADC9))  [also labelled PK1_ADC9_PCI17_A9]
LD3: CN13.3 M1.A10(PK2_(ADC10))  [also labelled PK2_ADC10_PCI18_A10]
LD4: CN13.4 M1.A11(PK3_(ADC11))  [also labelled PK3_ADC11_PCI19_A11]
LD5: CN13.5 M1.A12(PK4_(ADC12))  [also labelled PK4_ADC12_PCI20_A12]
LD6: CN13.6 M1.A13(PK5_(ADC13))  [also labelled PK5_ADC13_PCI21_A13]
LEDON: CN13.7 M1.A14(PK6_(ADC14))  [also labelled PK6_ADC14_PCI22_A14]
LIGHT_SENSOR: CN4.3 CN6.3 M1.A2(PF2_(ADC2)) M2.A2(PC2_(ADC2))  [also labelled PC2_ADC2_PCI10_A2, PF2_ADC2_A2]
LIGHTS_FRONT: CN8.7 CN9.7 M1.D6(PH3_(OC4A)) M2.D6(PD6_(OC0A/AIN0))  [also labelled PD6_OC0A_PCI22_AIN0_D6, PH3_OC4A_D6]
LIGHTS_REAR: CN8.6 CN9.6 M1.D5(PE3_(OC3A/AIN1)) M2.D5(PD5_(OC0B/T1))  [also labelled PD5_OC0B_T1_PCI21_D5, PE3_OC3A_AIN1_D5]
LIGHTS_TURN_LEFT: CN8.5 CN9.5 M1.D4(PG5_(OC0B)) M2.D4(PD4_(T0))  [also labelled PD4_T0_XCK_D4, PG5_OC0B_D4]
LIGHTS_TURN_RIGHT: CN10.5 CN11.5 M1.D12(PB6_(OC1B)) M2.D12(PB4_(MISO))  [also labelled PB4_MISO_PCI4_D12, PB6_OC1B_PCI6_D12]
MISO_5V: R22.2
MOSI_5V: R20.1
NRF24_CE: CN7.29 M1.D48(PL1)  [also labelled PL1_ICP5_D48]
NRF24_CSN: CN7.30 M1.D49(PL0)  [also labelled PL0_ICP4_D49]
NRF24_IRQ: CN7.23 M1.D42(PL7)  [also labelled PL7_D42]
PA0_AD0_D22: CN7.3 M1.D22(PA0)
PA1_AD1_D23: CN7.4 M1.D23(PA1)
PA2_AD2_D24: CN7.5 M1.D24(PA2)
PA3_AD3_D25: CN7.6 M1.D25(PA3)
PA4_AD4_D26: CN7.7 M1.D26(PA4)
PA5_AD5_D27: CN7.8 M1.D27(PA5)
PA6_AD6_D28: CN7.9 M1.D28(PA6)
PA7_AD7_D29: CN7.10 M1.D29(PA7)
PB0_nSS_PCI0_D53: CN7.34 M1.D53(PB0_(nSS))
PB1_SCK_PCI1_D52: CN7.33 M1.D52(PB1_(SCLK)) R21.1
PB2_MOSI_PCI2_D51: CN7.32 M1.D51(PB2_(MOSI)) R20.2
PB3_MISO_PCI3_D50: CN7.31 M1.D50(PB3_(MISO)) R22.1
PC0_A8_D37: CN7.18 M1.D37(PC0)
PC0_ADC0_PCI8_A0: CN4.1 CN6.1 M1.A0(PF0_(ADC0)) M2.A0(PC0_(ADC0))  [also labelled PF0_ADC0_A0, POT_IN]
PC1_A9_D36: CN7.17 M1.D36(PC1)  [also labelled PROX_REAR]
PC1_ADC1_PCI9_A1: CN4.2 CN6.2 M1.A1(PF1_(ADC1)) M2.A1(PC1_(ADC1))  [also labelled PF1_ADC1_A1, WS2812_IN]
PC2_A10_D35: CN7.16 M1.D35(PC2)
PC3_A11_D34: CN7.15 M1.D34(PC3)
PC3_ADC3_PCI11_A3: CN4.4 CN6.4 M1.A3(PF3_(ADC3)) M2.A3(PC3_(ADC3))  [also labelled PF3_ADC3_A3, TEMP_SENSOR]
PC4_A12_D33: CN7.14 M1.D33(PC4)
PC4_ADC4_SDA_PCI12_A4: CN6.5 CN10.9 CN11.9 CN12.7 M1.D20(PD1_(SDA/INT1)) M1.SDA(PD1_(SDA/INT1)) M2.A4(PC4_(ADC4/SCL)) M2.SDA(PC4_(SDA/ADC4))  [also labelled PD1_SDA_INT1_D20]
PC5_A13_D32: CN7.13 M1.D32(PC5)
PC5_ADC5_SCL_PCI13_A5: CN6.6 CN10.10 CN11.10 CN12.8 M1.D21(PD0_(SCL/INT0)) M1.SCL(PD0_(SCL/INT0)) M2.A5(PC5_(ADC5/SDA)) M2.SCL(PC5_(SCL/ADC5))  [also labelled PD0_SCL_INT0_D21]
PC6_A12_D31: CN7.12 M1.D31(PC6)
PC7_A13_D30: CN7.11 M1.D30(PC7)
PD0_RXD_PCI6_D0: CN8.1 CN9.1 M1.D0(PE0_(RXD0)) M2.D0(PD0_(RXD))  [also labelled PE0_RXD0_PCI8_D0, RxD]
PD1_TXD_PCI17_D1: CN8.2 CN9.2 M1.D1(PE1_(TXD0)) M2.D1(PD1_(TXD))  [also labelled PE1_TXD0_D1, TxD]
PD2_INT0_PCI18_D2: CN8.3 CN9.3 M1.D2(PE4_(OC3B/INT4)) M2.D2(PD2_(INT0))  [also labelled PE4_OC3B_INT4_D2, PH_LEFT]
PD3_INT1_OC2B_PCI19_D3: CN8.4 CN9.4 M1.D3(PE5_(OC3C/INT5)) M2.D3(PD3_(INT1/OC2B))  [also labelled PE5_OC3C_INT5_D3, PH_RIGHT]
PD7_AIN1_PCI23_D7: CN8.8 CN9.8 M1.D7(PH4_(OC4B)) M2.D7(PD7_(AIN1))  [also labelled PH4_OC4B_D7, TRIG_F]
PF4_ADC4_TCK_A4: CN4.5 M1.A4(PF4_(ADC4/TCK))
PF5_ADC5_TMS_A5: CN4.6 M1.A5(PF5_(ADC5/TMS))
PF6_ADC6_TDO_A6: CN4.7 M1.A6(PF6_(ADC6/TDO))
PF7_ADC7_TDI_A7: CN4.8 M1.A7(PF7_(ADC7/TDI))
PG0_nWR_D41: CN7.22 M1.D41(PG0)
PG1_nRD_D40: CN7.21 M1.D40(PG1)  [also labelled TRIG_R]
PG2_ALE_D39: CN7.20 M1.D39(PG2)
PH0_RXD2_D17: CN12.4 M1.D17(PH0_(RXD2))  [also labelled SERVO_F]
PH1_TXD2_D16: CN12.3 M1.D16(PH1_(TXD2))  [also labelled SERVO_R]
PJ0_RXD3_PCI9_D15: CN12.2 M1.D15(PJ0_(RXD3))  [also labelled PROX_FL]
PJ1_TXD3_PCI10_D14: CN12.1 M1.D14(PJ1_(TXD3))  [also labelled PROX_FR]
PL2_T5_D47: CN7.28 M1.D47(PL2)
PL3_OC5A_D46: CN7.27 M1.D46(PL3)
PL4_OC5B_D45: CN7.26 M1.D45(PL4)
PL5_OC5C_D44: CN7.25 M1.D44(PL5)
PL6_D43: CN7.24 M1.D43(PL6)
RESET: CN5.3 M1.P3(RESET) M2.P3(RESET)
SCK_5V: R21.2
NetCN5_8: CN5.8 M1.P8(VIN) M2.P8(VIN)

Not connected (* = marked no-connect by the designer): CN5 1*

### Notes on the sheet
- REV:
- A  P  P  R  O  V  E  D
- /
- Lodz University of Technology
- ul. Wolczanska 211/215
- 90-924 LODZ, POLAND
- Institute of Electronics
- Project name:
- Title:
- Author:
- Verified by:

### Library data of the parts
M1 = Arduino MEGA Rev3: Arduino MEGA Rev3 Board
M2 = Arduino UNO Rev3: Arduino UNO Rev3 Board
R20-R22 = Res: Resistor; Published: 19-Feb-2006; ComponentLink1Description: datasheet; ComponentLink2Description: supplier; Value: 1k

## Sheet [07] - PERIPHERALS B.SchDoc: Test title
size A4; Date: YYYY-MM-DD; Engineer: X; SheetNumber: 7; Size: A4
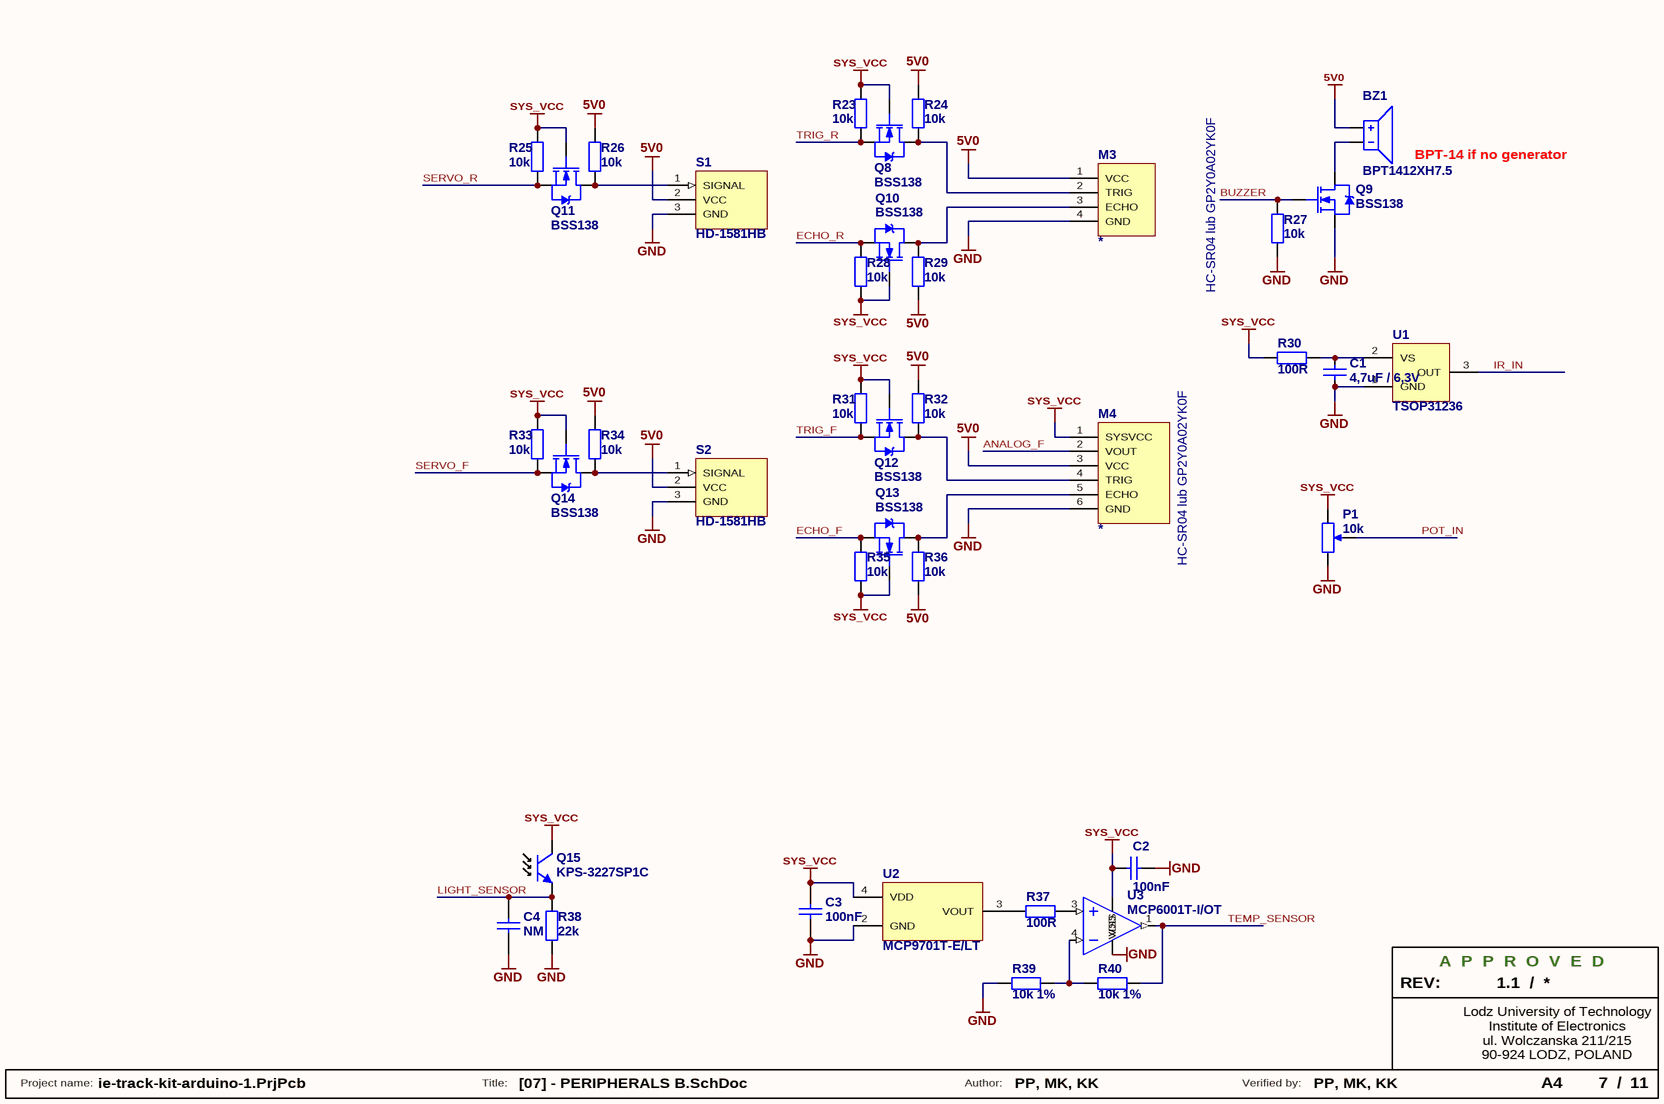
[diagram p8: [07] - PERIPHERALS B.SchDoc]

### Parts
BZ1  BPT1412XH7.5  [BUZ-13,8-7,6]
C1  4,7uF / 6,3V  [C0805]
C2  100nF  [C0805]
C3  100nF  [C0805]
C4  NM  [C0805]
M3  *  [HC-SR04]
M4  *  [HC-SR04_UNIV]
P1  10k  [RK09K113004U]
Q8  BSS138  [SOT-23]
Q9  BSS138  [SOT-23]
Q10  BSS138  [SOT-23]
Q11  BSS138  [SOT-23]
Q12  BSS138  [SOT-23]
Q13  BSS138  [SOT-23]
Q14  BSS138  [SOT-23]
Q15  KPS-3227SP1C  [KPS-3227]
R23  10k  [R0805]
R24  10k  [R0805]
R25  10k  [R0805]
R26  10k  [R0805]
R27  10k  [R0805]
R28  10k  [R0805]
R29  10k  [R0805]
R30  100R  [R0805]
R31  10k  [R0805]
R32  10k  [R0805]
R33  10k  [R0805]
R34  10k  [R0805]
R35  10k  [R0805]
R36  10k  [R0805]
R37  100R  [R0805]
R38  22k  [R0805]
R39  10k 1%  [R0805]
R40  10k 1%  [R0805]
S1  HD-1581HB  [HD-1581HB_VERTICAL_1]
S2  HD-1581HB  [HD-1581HB_VERTICAL_1]
U1  TSOP31236  [TSOP312(4)_H]
U2  MCP9701T-E/LT  [SOT-323-5 (SOT-353, SC70-5)]
U3  MCP6001T-I/OT  [SOT-23-5]

### Nets
5V0: BZ1.1 M3.1(VCC) M4.3(VCC) R24.2 R26.2 R29.2 R32.2 R34.2 R36.2 S1.2(VCC) S2.2(VCC)
GND: C1.1 C2.2 C3.1 C4.1 M3.4(GND) M4.6(GND) P1.3(BOT) Q9.2(S) R27.2 R38.2 R39.2 S1.3(GND) S2.3(GND) U1.1(GND) U2.2(GND) U3.2(VSS)
SYS_VCC: C2.1 C3.2 M4.1(SYSVCC) P1.1(TOP) Q8.1(G) Q10.1(G) Q11.1(G) Q12.1(G) Q13.1(G) Q14.1(G) Q15.2(C) R23.2 R25.2 R28.2 R30.1 R31.2 R33.2 R35.2 U2.4(VDD) U3.5(VDD)
ANALOG_F: M4.2(VOUT)
BUZZER: Q9.1(G) R27.1
ECHO_F: Q13.2(S) R35.1
ECHO_R: Q10.2(S) R28.1
IR_IN: U1.3(OUT)
LIGHT_SENSOR: C4.2 Q15.1(E) R38.1
POT_IN: P1.2(TAP)  [project net PC0_ADC0_PCI8_A0]
SERVO_F: Q14.2(S) R33.1  [project net PH0_RXD2_D17]
SERVO_R: Q11.2(S) R25.1  [project net PH1_TXD2_D16]
TEMP_SENSOR: R40.1 U3.1(OUT)  [project net PC3_ADC3_PCI11_A3]
TRIG_F: Q12.2(S) R31.1  [project net PD7_AIN1_PCI23_D7]
TRIG_R: Q8.2(S) R23.1  [project net PG1_nRD_D40]
NetBZ1_2: BZ1.2 Q9.3(D)
NetC1_2: C1.2 R30.2 U1.2(VS)
NetM3_2: M3.2(TRIG) Q8.3(D) R24.1
NetM3_3: M3.3(ECHO) Q10.3(D) R29.1
NetM4_4: M4.4(TRIG) Q12.3(D) R32.1
NetM4_5: M4.5(ECHO) Q13.3(D) R36.1
NetQ11_3: Q11.3(D) R26.1 S1.1(SIGNAL)
NetQ14_3: Q14.3(D) R34.1 S2.1(SIGNAL)
NetR37_1: R37.1 U3.3(IN+)
NetR37_2: R37.2 U2.3(VOUT)
NetR39_1: R39.1 R40.2 U3.4(IN-)

### Notes on the sheet
- (near BZ1) BPT-14 if no generator
- HC-SR04 lub GP2Y0A02YK0F
- REV:
- A  P  P  R  O  V  E  D
- /
- Lodz University of Technology
- ul. Wolczanska 211/215
- 90-924 LODZ, POLAND
- Institute of Electronics
- Project name:
- Title:
- Author:
- Verified by:

### Library data of the parts
BZ1 = BPT1412XH7.5: Piezoelectric Sound Transducer: 5Vp-p; 4kHz; O:14mm; with generator; Published: 24-Mar-1999; Revision: July-2002: Re-released for DXP Platform.; Publisher: Altium Limited
C1-C4 = Cap: Capacitor; ComponentLink1Description: datasheet; ComponentLink2Description: supplier
  C1: Value: 4,7uF / 6,3V
  C2 C3: Value: 100nF
  C4: Value: NM
M3 = HC-SR04
M4 = HC-SR04_UNIVERSAL
P1 = RK09K113004U: Published: 21-10-2009; ComponentLink1Description: datasheet; ComponentLink2Description: supplier; Value: 10k
Q8-Q14 = BSS138: as Q1 on sheet [05] - DEBUGGING & PROGRAMMING; Published: 17-Dec-2003; DatasheetVersion: Mar-96; PackageVersion: 1996; PackageReference: SOT23; Publisher: Altium Limited; PackageDescription: SOT-23; 3 Leads; Body 3.1 x 2.5 mm, inc. leads (LxW max), Alternate Lead Configuration; ComponentLink1Description: Manufacturer Link; ComponentLink1URL: http://www.zetex.com/; ComponentLink2Description: Datasheet; ComponentLink2URL: www.zetex.com/3.0/pdf/BSS138.pdf
Q15 = KPS-3227SP1C: Photo Transistor 60V 0,1mA 580nm (TME KPS-3227SP1C); Supplier 1: TME; Supplier Part Number 1: ELPT15-21C
R23-R40 = Res: Resistor; Published: 19-Feb-2006; ComponentLink1Description: datasheet; ComponentLink2Description: supplier
  R23-R29 R31-R36: Value: 10k
  R30 R37: Value: 100R
  R38: Value: 22k
  R39 R40: Value: 10k 1%
S1 S2 = HD-1581HB: HD-1581HB Micro Servo
U1 = TSOP31236: 36kHz IR Receiver Module for Remote Control Systems
U2 = MCP9701T-E/LT: Low-Power Linear Active Thermistor IC
U3 = MCP6001T-I/OT: Rail-to-rail, 1MHz, 100uA Op Amp; Supplier 1: Farnell; Supplier 2: Farnell; Supplier 3: Farnell; Supplier 4: TME; Supplier 5: TME; Supplier 6: Farnell; Supplier Part Number 1: 4974992; Supplier Part Number 2: 2412853; Supplier Part Number 3: 4974992RL; Supplier Part Number 4: TS912ID; Supplier Part Number 5: MCP6001T-I/OT; Supplier Part Number 6: 1094386

## Sheet [08] - PERIPHERALS C.SchDoc: Test title
size A4; Date: YYYY-MM-DD; Engineer: X; SheetNumber: 8; Size: A4
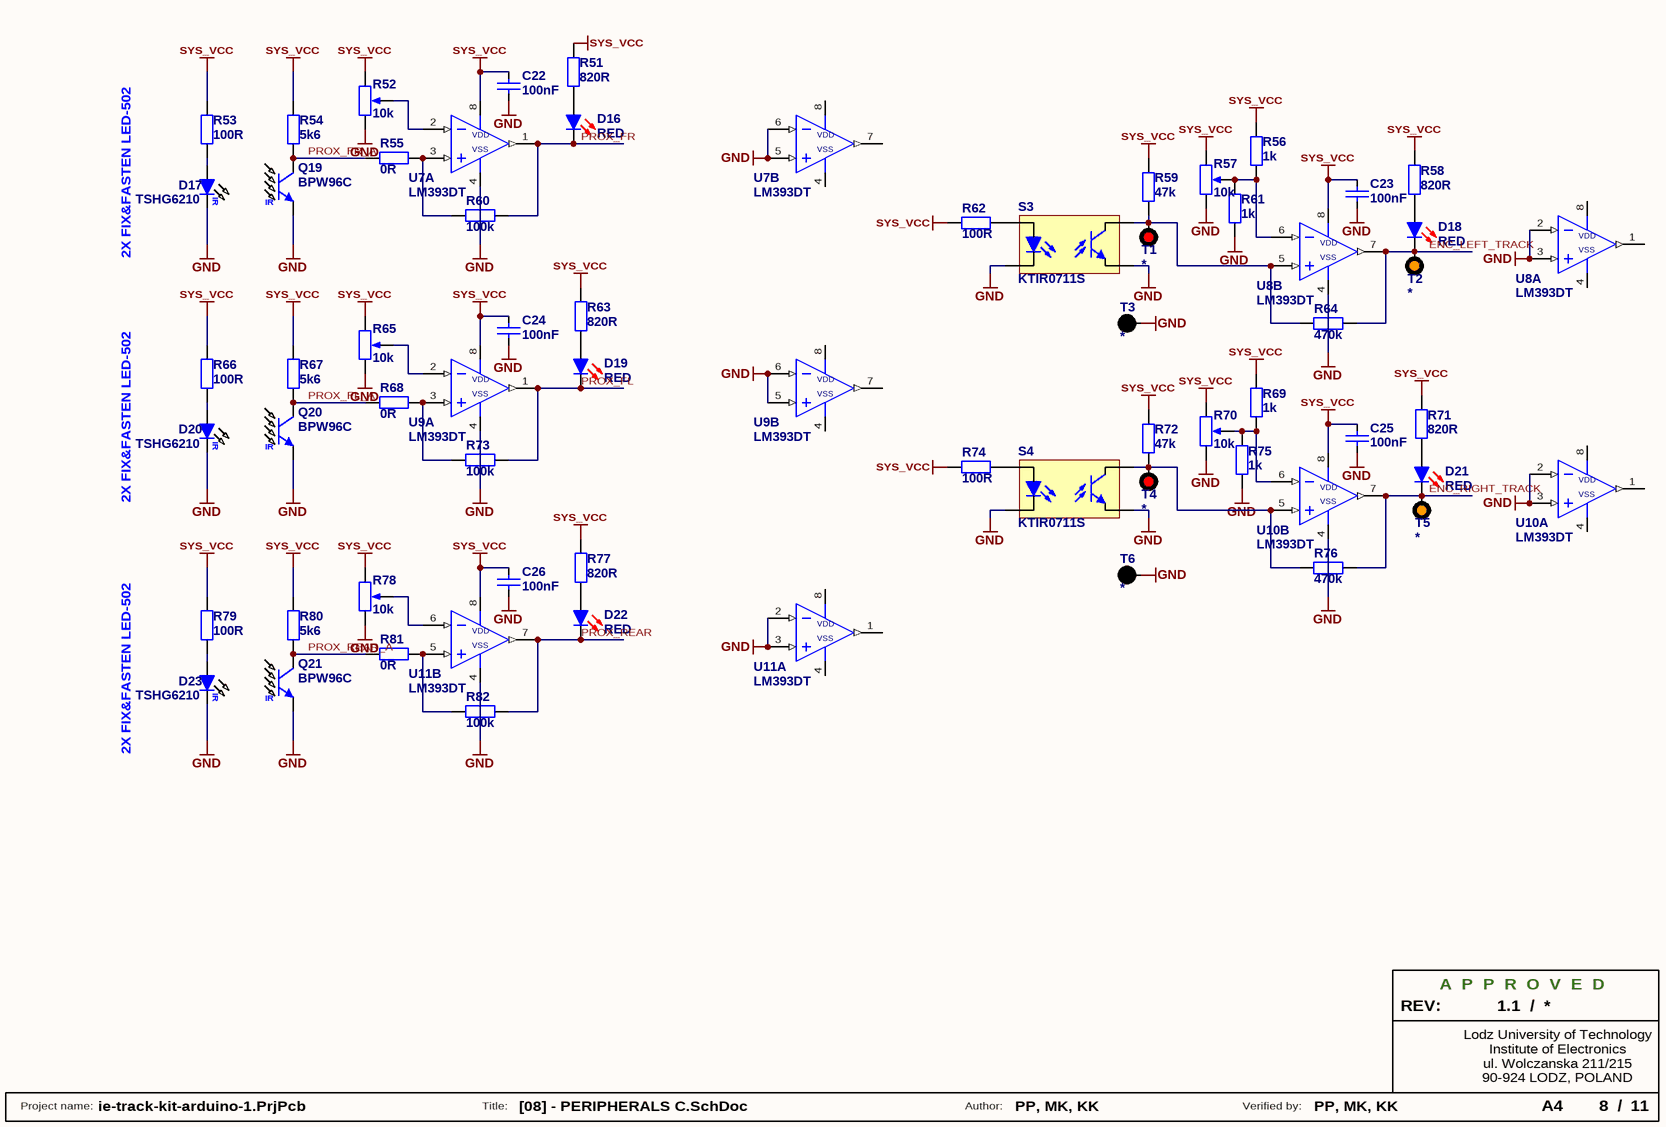
[diagram p9: [08] - PERIPHERALS C.SchDoc]

### Parts
C22  100nF  [C0805]
C23  100nF  [C0805]
C24  100nF  [C0805]
C25  100nF  [C0805]
C26  100nF  [C0805]
D16  RED  [LED0805R]
D17  TSHG6210  [LED-502]
D18  RED  [LED0805R]
D19  RED  [LED0805R]
D20  TSHG6210  [LED-502]
D21  RED  [LED0805R]
D22  RED  [LED0805R]
D23  TSHG6210  [LED-502]
Q19  BPW96C  [LED-502]
Q20  BPW96C  [LED-502]
Q21  BPW96C  [LED-502]
R51  820R  [R0805]
R52  value 10k  [3305SMD]  (hidden comment: *)
R53  100R  [R0805]
R54  5k6  [R0805]
R55  0R  [R0805]
R56  1k  [R0805]
R57  value 10k  [3305SMD]  (hidden comment: *)
R58  820R  [R0805]
R59  47k  [R0805]
R60  100k  [R0805]
R61  1k  [R0805]
R62  100R  [R0805]
R63  820R  [R0805]
R64  470k  [R0805]
R65  value 10k  [3305SMD]  (hidden comment: *)
R66  100R  [R0805]
R67  5k6  [R0805]
R68  0R  [R0805]
R69  1k  [R0805]
R70  value 10k  [3305SMD]  (hidden comment: *)
R71  820R  [R0805]
R72  47k  [R0805]
R73  100k  [R0805]
R74  100R  [R0805]
R75  1k  [R0805]
R76  470k  [R0805]
R77  820R  [R0805]
R78  value 10k  [3305SMD]  (hidden comment: *)
R79  100R  [R0805]
R80  5k6  [R0805]
R81  0R  [R0805]
R82  100k  [R0805]
S3  KTIR0711S  [KTIR0711S_wide_pads]
S4  KTIR0711S  [KTIR0711S_wide_pads]
T1  *  [Keystone_5000_RED]
T2  *  [Keystone_5003_ORANGE]
T3  *  [Keystone_5001_BLACK]
T4  *  [Keystone_5000_RED]
T5  *  [Keystone_5003_ORANGE]
T6  *  [Keystone_5001_BLACK]
U7  LM393DT  [SO8]  (parts A,B of 2)
U8  LM393DT  [SO8]  (parts A,B of 2)
U9  LM393DT  [SO8]  (parts A,B of 2)
U10  LM393DT  [SO8]  (parts A,B of 2)
U11  LM393DT  [SO8]  (parts A,B of 2)

### Nets
GND: C22.2 C23.2 C24.2 C25.2 C26.2 D17.2(K) D20.2(K) D23.2(K) Q19.1(E) Q20.1(E) Q21.1(E) R52.2(BOT) R57.2(BOT) R61.2 R65.2(BOT) R70.2(BOT) R75.2 R78.2(BOT) S3.2(E) S3.4(K) S4.2(E) S4.4(K) T3.0 T6.0 U7.4(GND) U7.5(IN+) U7.6(IN-) U8.2(IN-) U8.3(IN+) U8.4(GND) U9.4(GND) U9.5(IN+) U9.6(IN-) U10.2(IN-) U10.3(IN+) U10.4(GND) U11.2(IN-) U11.3(IN+) U11.4(GND)
SYS_VCC: C22.1 C23.1 C24.1 C25.1 C26.1 R51.1 R52.1(TOP) R53.1 R54.1 R56.1 R57.1(TOP) R58.1 R59.2 R62.2 R63.1 R65.1(TOP) R66.1 R67.1 R69.1 R70.1(TOP) R71.1 R72.2 R74.2 R77.1 R78.1(TOP) R79.1 R80.1 U7.8(V+) U8.8(V+) U9.8(V+) U10.8(V+) U11.8(V+)
ENC_LEFT_TRACK: D18.2(K) R64.2 T2.0 U8.7(OUT)
ENC_RIGHT_TRACK: D21.2(K) R76.2 T5.0 U10.7(OUT)
PROX_FL: D19.2(K) R73.2 U9.1(OUT)  [project net PJ0_RXD3_PCI9_D15]
PROX_FL_A: Q20.2(C) R67.2 R68.1
PROX_FR: D16.2(K) R60.2 U7.1(OUT)  [project net PJ1_TXD3_PCI10_D14]
PROX_FR_A: Q19.2(C) R54.2 R55.1
PROX_REAR: D22.2(K) R82.2 U11.7(OUT)  [project net PC1_A9_D36]
PROX_REAR_A: Q21.2(C) R80.2 R81.1
NetD16_1: D16.1(A) R51.2
NetD17_1: D17.1(A) R53.2
NetD18_1: D18.1(A) R58.2
NetD19_1: D19.1(A) R63.2
NetD20_1: D20.1(A) R66.2
NetD21_1: D21.1(A) R71.2
NetD22_1: D22.1(A) R77.2
NetD23_1: D23.1(A) R79.2
NetR52_3: R52.3(TAP) U7.2(IN-)
NetR55_2: R55.2 R60.1 U7.3(IN+)
NetR56_2: R56.2 R57.3(TAP) R61.1 U8.6(IN-)
NetR59_1: R59.1 R64.1 S3.3(C) T1.0 U8.5(IN+)
NetR62_1: R62.1 S3.1(A)
NetR65_3: R65.3(TAP) U9.2(IN-)
NetR68_2: R68.2 R73.1 U9.3(IN+)
NetR69_2: R69.2 R70.3(TAP) R75.1 U10.6(IN-)
NetR72_1: R72.1 R76.1 S4.3(C) T4.0 U10.5(IN+)
NetR74_1: R74.1 S4.1(A)
NetR78_3: R78.3(TAP) U11.6(IN-)
NetR81_2: R81.2 R82.1 U11.5(IN+)

Not connected (* = marked no-connect by the designer): U7 7(OUT); U8 1(OUT); U9 7(OUT); U10 1(OUT); U11 1(OUT)

### Notes on the sheet
- 2X FIX&FASTEN LED-502
- REV:
- A  P  P  R  O  V  E  D
- /
- Lodz University of Technology
- ul. Wolczanska 211/215
- 90-924 LODZ, POLAND
- Institute of Electronics
- Project name:
- Title:
- Author:
- Verified by:
- (in symbol BPW96C) IR
- (in symbol LM393DT, part A) VDD; VSS
- (in symbol LM393DT, part B) VDD; VSS
- (in symbol TSHG6210) IR

### Library data of the parts
C22-C26 = Cap: Capacitor; ComponentLink1Description: datasheet; ComponentLink2Description: supplier; Value: 100nF
D16 D18 D19 D21 D22 = LED_RED: RED LED; Published: 04-Apr-2006
D17 D20 D23 = TSHG6210: IR transmitter; 5mm; 850nm; transparent; 230mW; 10°; THT; 1.5÷1.8V; Published: 04-Apr-2006
Q19-Q21 = BPW96C: Phototransistor; λp max:850nm; 70V; 20°; Lens: transparent; Ø:5mm; Supplier 1: TME; Supplier Part Number 1: ELPT15-21C
R51 R53-R56 R58-R64 R66-R69 R71-R77 R79-R82 = Res: Resistor; Published: 19-Feb-2006; ComponentLink1Description: datasheet; ComponentLink2Description: supplier
  R51 R58 R63 R71 R77: Value: 820R
  R53 R62 R66 R74 R79: Value: 100R
  R54 R67 R80: Value: 5k6
  R55 R68 R81: Value: 0R
  R56 R61 R69 R75: Value: 1k
  R59 R72: Value: 47k
  R60 R73 R82: Value: 100k
  R64 R76: Value: 470k
R52 R57 R65 R70 R78 = 3305SMD-10K: Published: 21-10-2009; ComponentLink1Description: datasheet; ComponentLink2Description: supplier
S3 S4 = KTIR0711S: SUBMINIATURE, HIGH SENSITIVITY PHOTOINTERRUPTER
T1 T4 = Keystone 5000 Test Point: Keystone 5000 Test Point (RED)
T2 T5 = Keystone 5003 Test Point: Keystone 5003 Test Point (ORANGE)
T3 T6 = Keystone 5001 Test Point: Keystone 5001 Test Point (BLACK)
U7-U11 = LM393DT: Low power dual voltage comparators; Published: 03-Apr-2006

## Sheet [09] - PERIPHERALS D.SchDoc: Test title
size A4; Date: YYYY-MM-DD; Engineer: X; SheetNumber: 9; Size: A4
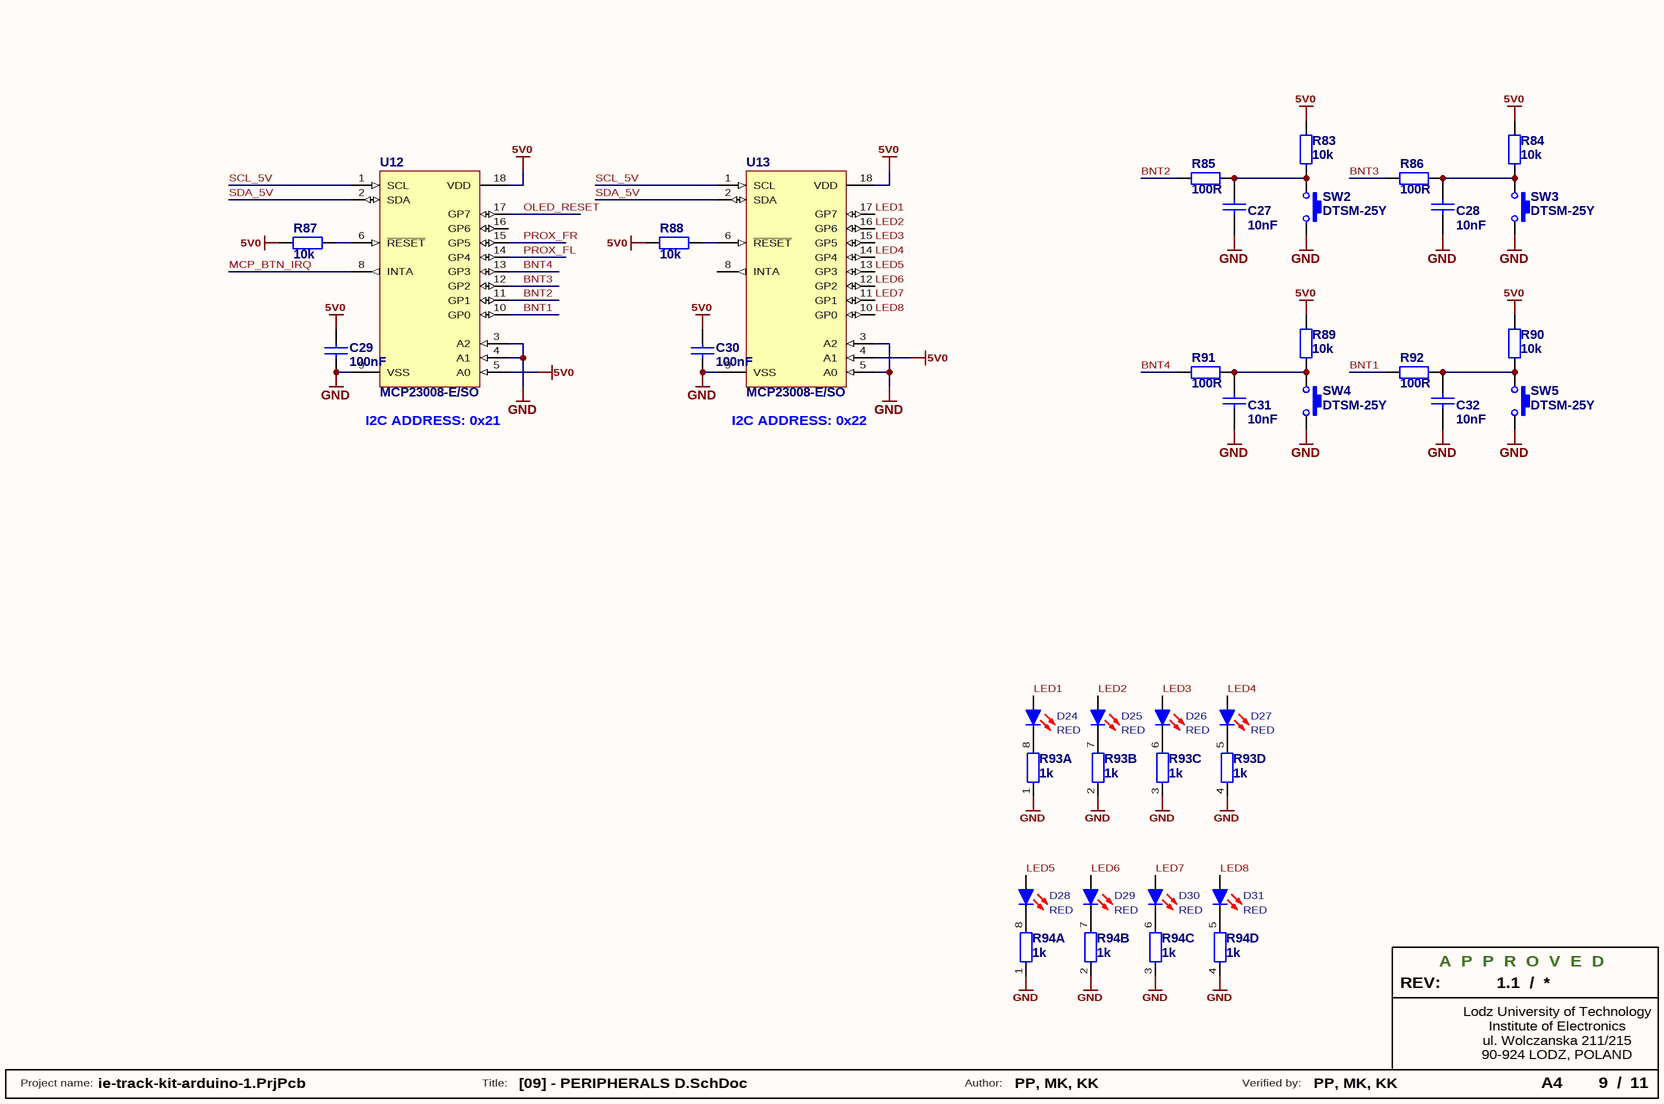
[diagram p10: [09] - PERIPHERALS D.SchDoc]

### Parts
C27  10nF  [C0805]
C28  10nF  [C0805]
C29  100nF  [C0805]
C30  100nF  [C0805]
C31  10nF  [C0805]
C32  10nF  [C0805]
D24  RED  [LED0805R]
D25  RED  [LED0805R]
D26  RED  [LED0805R]
D27  RED  [LED0805R]
D28  RED  [LED0805R]
D29  RED  [LED0805R]
D30  RED  [LED0805R]
D31  RED  [LED0805R]
R83  10k  [R0805]
R84  10k  [R0805]
R85  100R  [R0805]
R86  100R  [R0805]
R87  10k  [R0805]
R88  10k  [R0805]
R89  10k  [R0805]
R90  10k  [R0805]
R91  100R  [R0805]
R92  100R  [R0805]
R93  1k  [RPack_0603x4_1206]  (parts A,B,C,D of 4)
R94  1k  [RPack_0603x4_1206]  (parts A,B,C,D of 4)
SW2  DTSM-25Y  [DTSM-25Y]
SW3  DTSM-25Y  [DTSM-25Y]
SW4  DTSM-25Y  [DTSM-25Y]
SW5  DTSM-25Y  [DTSM-25Y]
U12  MCP23008-E/SO  [SO18W]
U13  MCP23008-E/SO  [SO18W]

### Nets
5V0: C29.2 C30.2 R83.2 R84.2 R87.1 R88.1 R89.2 R90.2 U12.5(A0) U12.18(VDD) U13.4(A1) U13.18(VDD)
GND: C27.1 C28.1 C29.1 C30.1 C31.1 C32.1 R93.1 R93.2 R93.3 R93.4 R94.1 R94.2 R94.3 R94.4 SW2.2 SW3.2 SW4.2 SW5.2 U12.3(A2) U12.4(A1) U12.9(VSS) U13.3(A2) U13.5(A0) U13.9(VSS)
BNT1: R92.1 U12.10(GP0)
BNT2: R85.1 U12.11(GP1)
BNT3: R86.1 U12.12(GP2)
BNT4: R91.1 U12.13(GP3)
LED1: D24.1(A) U13.17(GP7)
LED2: D25.1(A) U13.16(GP6)
LED3: D26.1(A) U13.15(GP5)
LED4: D27.1(A) U13.14(GP4)
LED5: D28.1(A) U13.13(GP3)
LED6: D29.1(A) U13.12(GP2)
LED7: D30.1(A) U13.11(GP1)
LED8: D31.1(A) U13.10(GP0)
MCP_BTN_IRQ: U12.8(INTA)
OLED_RESET: U12.17(GP7)
PROX_FL: U12.14(GP4)  [project net PJ0_RXD3_PCI9_D15]
PROX_FR: U12.15(GP5)  [project net PJ1_TXD3_PCI10_D14]
SCL_5V: U12.1(SCL) U13.1(SCL)  [project net PC5_ADC5_SCL_PCI13_A5]
SDA_5V: U12.2(SDA) U13.2(SDA)  [project net PC4_ADC4_SDA_PCI12_A4]
NetC27_2: C27.2 R83.1 R85.2 SW2.1
NetC28_2: C28.2 R84.1 R86.2 SW3.1
NetC31_2: C31.2 R89.1 R91.2 SW4.1
NetC32_2: C32.2 R90.1 R92.2 SW5.1
NetD24_2: D24.2(K) R93.8
NetD25_2: D25.2(K) R93.7
NetD26_2: D26.2(K) R93.6
NetD27_2: D27.2(K) R93.5
NetD28_2: D28.2(K) R94.8
NetD29_2: D29.2(K) R94.7
NetD30_2: D30.2(K) R94.6
NetD31_2: D31.2(K) R94.5
NetR87_2: R87.2 U12.6(~{RESET})
NetR88_2: R88.2 U13.6(~{RESET})

Not connected (* = marked no-connect by the designer): U12 16(GP6); U13 8(INTA)

### Notes on the sheet
- I2C ADDRESS: 0x21
- I2C ADDRESS: 0x22
- REV:
- A  P  P  R  O  V  E  D
- /
- Lodz University of Technology
- ul. Wolczanska 211/215
- 90-924 LODZ, POLAND
- Institute of Electronics
- Project name:
- Title:
- Author:
- Verified by:

### Library data of the parts
C27-C32 = Cap: Capacitor; ComponentLink1Description: datasheet; ComponentLink2Description: supplier
  C27 C28 C31 C32: Value: 10nF
  C29 C30: Value: 100nF
D24-D31 = LED_RED: RED LED; Published: 04-Apr-2006
R83-R92 = Res: Resistor; Published: 19-Feb-2006; ComponentLink1Description: datasheet; ComponentLink2Description: supplier
  R83 R84 R87-R90: Value: 10k
  R85 R86 R91 R92: Value: 100R
R93 R94 = Res Pack4_1: Isolated Resistor Network - Parts; Sim Note: Enter the Resistance value into parameter field.; Published: 24-Mar-1999; LatestRevisionDate: 17-Jul-2002; LatestRevisionNote: Re-released for DXP Platform.; PackageReference: DIP-16; Publisher: Altium Limited; Code_JEDEC: MO-001-AC; Value: 1k
SW2-SW5 = DTSM-25Y: DIPTRONICS Yellow 12x12mm SMD Tactile SPST-NO Switch; Supplier 1: TME; Supplier Part Number 1: DTSM-25Y-V-B
U12 U13 = MCP23008-E/SO: as U5 on sheet [06] - PERIPHERALS A

## Nets that join several sheets
3V3: [05] - DEBUGGING & PROGRAMMING (14 pins), [06] - PERIPHERALS A (C17.2 Q18.1 R49.2 U6.1), [10] - COMMUNICATION (7 pins), [11] - CONNECTOR (13 pins), [04] - ARDUINO UNO (MEGA) (CN5.4 M1.P4 M2.P4)
5V0: [06] - PERIPHERALS A (38 pins), [10] - COMMUNICATION (5 pins), [11] - CONNECTOR (11 pins), [04] - ARDUINO UNO (MEGA) (6 pins), [07] - PERIPHERALS B (11 pins), [09] - PERIPHERALS D (12 pins)
7V2: [10] - COMMUNICATION (R95.1), [11] - CONNECTOR (9 pins)
GND: [03] - BLOCK DIAGRAM (6 pins), [05] - DEBUGGING & PROGRAMMING (10 pins), [06] - PERIPHERALS A (46 pins), [10] - COMMUNICATION (12 pins), [11] - CONNECTOR (27 pins), [04] - ARDUINO UNO (MEGA) (12 pins), [07] - PERIPHERALS B (16 pins), [08] - PERIPHERALS C (39 pins), [09] - PERIPHERALS D (24 pins)
SYS_VCC: [05] - DEBUGGING & PROGRAMMING (14 pins), [06] - PERIPHERALS A (Q16.1 R41.2 R50.2), [10] - COMMUNICATION (R98.1 R100.1 R102.1), [11] - CONNECTOR (8 pins), [04] - ARDUINO UNO (MEGA) (CN5.2 M1.P2 M2.P2), [07] - PERIPHERALS B (20 pins), [08] - PERIPHERALS C (32 pins)
ANALOG_F: [04] - ARDUINO UNO (MEGA) (CN13.8 M1.A15), [07] - PERIPHERALS B (M4.2)
BUZZER: [04] - ARDUINO UNO (MEGA) (CN10.4 CN11.4 M1.D11 M2.D11), [07] - PERIPHERALS B (Q9.1 R27.1)
ECHO_F: [04] - ARDUINO UNO (MEGA) (CN10.1 CN11.1 M1.D8 M2.D8), [07] - PERIPHERALS B (Q13.2 R35.1)
ECHO_R: [04] - ARDUINO UNO (MEGA) (CN7.19 M1.D38), [07] - PERIPHERALS B (Q10.2 R28.1)
EN_LEFT: [11] - CONNECTOR (CN19.17), [04] - ARDUINO UNO (MEGA) (CN10.3 CN11.3 M1.D10 M2.D10)
EN_RIGHT: [11] - CONNECTOR (CN19.18), [04] - ARDUINO UNO (MEGA) (CN10.2 CN11.2 M1.D9 M2.D9)
ENC_LEFT_TRACK: [04] - ARDUINO UNO (MEGA) (CN12.6 M1.D19), [08] - PERIPHERALS C (D18.2 R64.2 T2.0 U8.7)
ENC_RIGHT_TRACK: [04] - ARDUINO UNO (MEGA) (CN12.5 M1.D18), [08] - PERIPHERALS C (D21.2 R76.2 T5.0 U10.7)
IR_IN: [04] - ARDUINO UNO (MEGA) (CN10.6 CN11.6 M1.D13 M2.D13), [07] - PERIPHERALS B (U1.3)
LD1: [11] - CONNECTOR (CN19.13), [04] - ARDUINO UNO (MEGA) (CN13.1 M1.A8)
LD2: [11] - CONNECTOR (CN19.11), [04] - ARDUINO UNO (MEGA) (CN13.2 M1.A9)
LD3: [11] - CONNECTOR (CN19.9), [04] - ARDUINO UNO (MEGA) (CN13.3 M1.A10)
LD4: [11] - CONNECTOR (CN19.7), [04] - ARDUINO UNO (MEGA) (CN13.4 M1.A11)
LD5: [11] - CONNECTOR (CN19.5), [04] - ARDUINO UNO (MEGA) (CN13.5 M1.A12)
LD6: [11] - CONNECTOR (CN19.3), [04] - ARDUINO UNO (MEGA) (CN13.6 M1.A13)
LEDON: [11] - CONNECTOR (CN19.14), [04] - ARDUINO UNO (MEGA) (CN13.7 M1.A14)
LIGHT_SENSOR: [04] - ARDUINO UNO (MEGA) (CN4.3 CN6.3 M1.A2 M2.A2), [07] - PERIPHERALS B (C4.2 Q15.1 R38.1)
LIGHTS_FRONT: [11] - CONNECTOR (CN19.10), [04] - ARDUINO UNO (MEGA) (CN8.7 CN9.7 M1.D6 M2.D6)
LIGHTS_REAR: [11] - CONNECTOR (CN19.8), [04] - ARDUINO UNO (MEGA) (CN8.6 CN9.6 M1.D5 M2.D5)
LIGHTS_TURN_LEFT: [11] - CONNECTOR (CN19.2), [04] - ARDUINO UNO (MEGA) (CN8.5 CN9.5 M1.D4 M2.D4)
LIGHTS_TURN_RIGHT: [11] - CONNECTOR (CN19.1), [04] - ARDUINO UNO (MEGA) (CN10.5 CN11.5 M1.D12 M2.D12)
MISO_3V3: [05] - DEBUGGING & PROGRAMMING (Q3.2 R7.1), [10] - COMMUNICATION (M5.7)
MISO_5V: [05] - DEBUGGING & PROGRAMMING (Q3.3 R8.1), [04] - ARDUINO UNO (MEGA) (R22.2)
MOSI_3V3: [05] - DEBUGGING & PROGRAMMING (Q1.2 R1.1), [10] - COMMUNICATION (M5.6)
MOSI_5V: [05] - DEBUGGING & PROGRAMMING (Q1.3 R2.1), [04] - ARDUINO UNO (MEGA) (R20.1)
NRF24_CE: [10] - COMMUNICATION (Q23.3 R98.2), [04] - ARDUINO UNO (MEGA) (CN7.29 M1.D48)
NRF24_CSN: [10] - COMMUNICATION (Q24.3 R100.2), [04] - ARDUINO UNO (MEGA) (CN7.30 M1.D49)
NRF24_IRQ: [10] - COMMUNICATION (Q25.3 R102.2), [04] - ARDUINO UNO (MEGA) (CN7.23 M1.D42)
OLED_RESET: [06] - PERIPHERALS A (Q18.3 R50.1), [09] - PERIPHERALS D (U12.17)
PC0_ADC0_PCI8_A0: [04] - ARDUINO UNO (MEGA) (CN4.1 CN6.1 M1.A0 M2.A0), [07] - PERIPHERALS B (P1.2)
PC1_A9_D36: [04] - ARDUINO UNO (MEGA) (CN7.17 M1.D36), [08] - PERIPHERALS C (D22.2 R82.2 U11.7)
PC1_ADC1_PCI9_A1: [06] - PERIPHERALS A (Q16.2 R41.1), [04] - ARDUINO UNO (MEGA) (CN4.2 CN6.2 M1.A1 M2.A1)
PC3_ADC3_PCI11_A3: [04] - ARDUINO UNO (MEGA) (CN4.4 CN6.4 M1.A3 M2.A3), [07] - PERIPHERALS B (R40.1 U3.1)
PC4_ADC4_SDA_PCI12_A4: [05] - DEBUGGING & PROGRAMMING (Q6.3 R16.1), [06] - PERIPHERALS A (CN14.4 U4.5 U5.2), [10] - COMMUNICATION (U15.4), [04] - ARDUINO UNO (MEGA) (8 pins), [09] - PERIPHERALS D (U12.2 U13.2)
PC5_ADC5_SCL_PCI13_A5: [05] - DEBUGGING & PROGRAMMING (Q7.3 R18.1), [06] - PERIPHERALS A (CN14.5 U4.6 U5.1), [10] - COMMUNICATION (U15.3), [04] - ARDUINO UNO (MEGA) (8 pins), [09] - PERIPHERALS D (U12.1 U13.1)
PD0_RXD_PCI6_D0: [05] - DEBUGGING & PROGRAMMING (R12.2), [04] - ARDUINO UNO (MEGA) (CN8.1 CN9.1 M1.D0 M2.D0)
PD1_TXD_PCI17_D1: [05] - DEBUGGING & PROGRAMMING (R6.2), [04] - ARDUINO UNO (MEGA) (CN8.2 CN9.2 M1.D1 M2.D1)
PD2_INT0_PCI18_D2: [11] - CONNECTOR (CN19.15), [04] - ARDUINO UNO (MEGA) (CN8.3 CN9.3 M1.D2 M2.D2)
PD3_INT1_OC2B_PCI19_D3: [11] - CONNECTOR (CN19.16), [04] - ARDUINO UNO (MEGA) (CN8.4 CN9.4 M1.D3 M2.D3)
PD7_AIN1_PCI23_D7: [04] - ARDUINO UNO (MEGA) (CN8.8 CN9.8 M1.D7 M2.D7), [07] - PERIPHERALS B (Q12.2 R31.1)
PF4_ADC4_TCK_A4: [05] - DEBUGGING & PROGRAMMING (CN1.1), [04] - ARDUINO UNO (MEGA) (CN4.5 M1.A4)
PF5_ADC5_TMS_A5: [05] - DEBUGGING & PROGRAMMING (CN1.5), [04] - ARDUINO UNO (MEGA) (CN4.6 M1.A5)
PF6_ADC6_TDO_A6: [05] - DEBUGGING & PROGRAMMING (CN1.3), [04] - ARDUINO UNO (MEGA) (CN4.7 M1.A6)
PF7_ADC7_TDI_A7: [05] - DEBUGGING & PROGRAMMING (CN1.9), [04] - ARDUINO UNO (MEGA) (CN4.8 M1.A7)
PG1_nRD_D40: [04] - ARDUINO UNO (MEGA) (CN7.21 M1.D40), [07] - PERIPHERALS B (Q8.2 R23.1)
PH0_RXD2_D17: [04] - ARDUINO UNO (MEGA) (CN12.4 M1.D17), [07] - PERIPHERALS B (Q14.2 R33.1)
PH1_TXD2_D16: [04] - ARDUINO UNO (MEGA) (CN12.3 M1.D16), [07] - PERIPHERALS B (Q11.2 R25.1)
PJ0_RXD3_PCI9_D15: [04] - ARDUINO UNO (MEGA) (CN12.2 M1.D15), [08] - PERIPHERALS C (D19.2 R73.2 U9.1), [09] - PERIPHERALS D (U12.14)
PJ1_TXD3_PCI10_D14: [04] - ARDUINO UNO (MEGA) (CN12.1 M1.D14), [08] - PERIPHERALS C (D16.2 R60.2 U7.1), [09] - PERIPHERALS D (U12.15)
RESET: [05] - DEBUGGING & PROGRAMMING (7 pins), [10] - COMMUNICATION (Q22.3), [04] - ARDUINO UNO (MEGA) (CN5.3 M1.P3 M2.P3)
RxD_HC05: [05] - DEBUGGING & PROGRAMMING (R11.1), [10] - COMMUNICATION (U16.3)
SCK_3V3: [05] - DEBUGGING & PROGRAMMING (Q5.2 R13.1), [10] - COMMUNICATION (M5.5)
SCK_5V: [05] - DEBUGGING & PROGRAMMING (Q5.3 R14.1), [04] - ARDUINO UNO (MEGA) (R21.2)
SCL_3V3: [05] - DEBUGGING & PROGRAMMING (Q7.2 R17.1), [06] - PERIPHERALS A (U6.5)
SDA_3V3: [05] - DEBUGGING & PROGRAMMING (Q6.2 R15.1), [06] - PERIPHERALS A (U6.4)
TxD_HC05: [05] - DEBUGGING & PROGRAMMING (R5.1), [10] - COMMUNICATION (U16.2)

## Assembly variants
ARDUINO MEGA: not fitted CN16 CN17 CN18 M1 M1
ARDUINO UNO: not fitted CN5 CN6 CN7 CN8 CN19 CN20 M2